# EAGLE design robot (EAGLE 6.1)

## Sheet 1 of 6
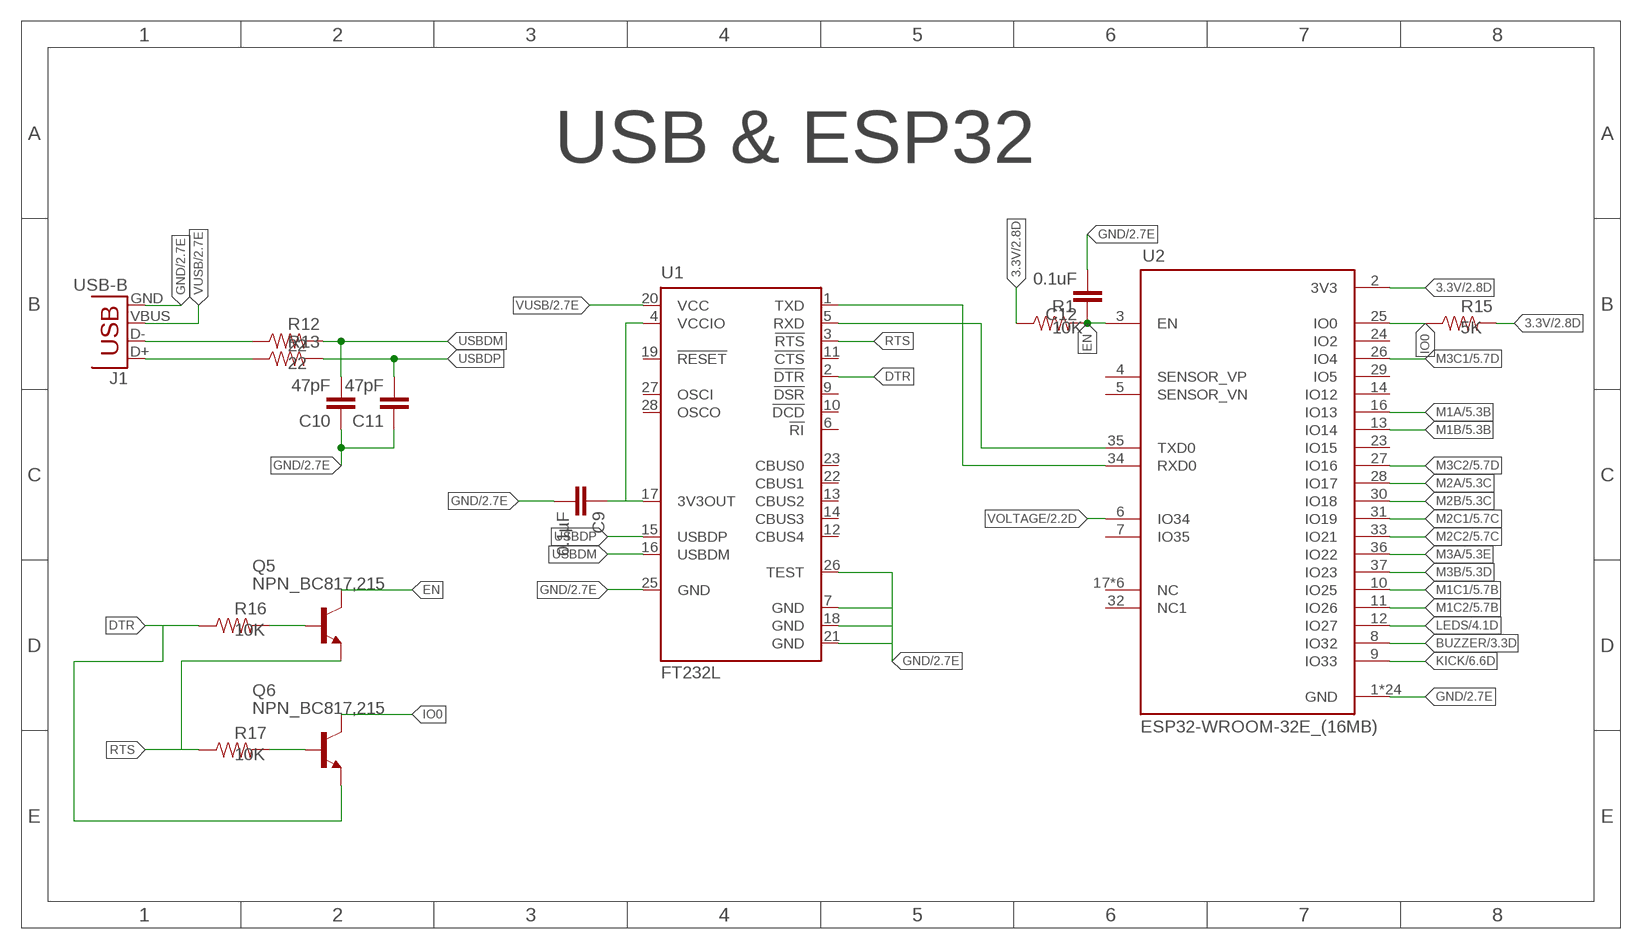
[diagram p0: schematic, sheet 1]

### Parts
C9  0.1µF  0.33UF/330NF-0805-50V-10%  [0805]
C10  47pF  CAP0805  [0805]
C11  47pF  CAP0805  [0805]
C12  0.1uF  CAP0805  [0805]
J1  USB-B  USBPTH  [USB-B-PTH]
Q5  NPN_BC817,215  [SOT-23]
Q6  NPN_BC817,215  [SOT-23]
R1  10K  0.3OHM-0805-1/8W-1%  [0805]
R12  22  0.3OHM-0805-1/8W-1%  [0805]
R13  22  0.3OHM-0805-1/8W-1%  [0805]
R15  5K  0.3OHM-0805-1/8W-1%  [0805]
R16  10K  0.3OHM-0805-1/8W-1%  [0805]
R17  10K  0.3OHM-0805-1/8W-1%  [0805]
U1  FT232L  [SSOP28]
U2  ESP32-WROOM-32E_(16MB)  [MODULE_ESP32-WROOM-32E_(16MB)]

### Nets
3.3V: R1.1 R15.2 U2.2(3V3) ; also sheet 2,3,5
BUZZER: U2.8(IO32) ; also sheet 3
DTR: Q6.2(E) R16.1 U1.2(!DTR)
EN: C12.1 Q5.3(C) R1.2 U2.3(EN)
GND [alime]: C9.2 C10.1 C11.1 C12.2 J1.GND U1.7(GND) U1.18(GND) U1.21(GND) U1.25(GND) U1.26(TEST) U2.1(GND) U2.15(GND) U2.38(GND) U2.39_1(GND) U2.39_2(GND) U2.39_3(GND) U2.39_4(GND) U2.39_5(GND) U2.39_6(GND) U2.39_7(GND) U2.39_8(GND) U2.39_9(GND) U2.39_10(GND) U2.39_11(GND) U2.39_12(GND) U2.39_13(GND) U2.39_14(GND) U2.39_15(GND) U2.39_16(GND) U2.39_17(GND) U2.39_18(GND) U2.39_19(GND) U2.39_20(GND) U2.39_21(GND) ; also sheet 2,3,4,5,6
IO0: Q6.3(C) R15.1 U2.25(IO0)
KICK: U2.9(IO33) ; also sheet 6
LEDS: U2.12(IO27) ; also sheet 4
M1A: U2.16(IO13) ; also sheet 5
M1B: U2.13(IO14) ; also sheet 5
M1C1: U2.10(IO25) ; also sheet 5
M1C2: U2.11(IO26) ; also sheet 5
M2A: U2.28(IO17) ; also sheet 5
M2B: U2.30(IO18) ; also sheet 5
M2C1: U2.31(IO19) ; also sheet 5
M2C2: U2.33(IO21) ; also sheet 5
M3A: U2.36(IO22) ; also sheet 5
M3B: U2.37(IO23) ; also sheet 5
M3C1: U2.26(IO4) ; also sheet 5
M3C2: U2.27(IO16) ; also sheet 5
N$6: U1.1(TXD) U2.34(RXD0)
N$14: U1.5(RXD) U2.35(TXD0)
N$15: C9.1 U1.4(VCCIO) U1.17(3V3OUT)
N$16: Q5.1(B) R16.2
N$17: Q6.1(B) R17.2
N$59: J1.D- R12.1
N$60: J1.D+ R13.1
RTS: Q5.2(E) R17.1 U1.3(!RTS)
USBDM: C10.2 R12.2 U1.16(USBDM)
USBDP: C11.2 R13.2 U1.15(USBDP)
VOLTAGE: U2.6(IO34) ; also sheet 2
VUSB [alime]: J1.VBUS U1.20(VCC) ; also sheet 2
Unconnected: U1.6(!RI) U1.9(!DSR) U1.10(!DCD) U1.11(!CTS) U1.12(CBUS4) U1.13(CBUS2) U1.14(CBUS3) U1.19(!RESET) U1.22(CBUS1) U1.23(CBUS0) U1.27(OSCI) U1.28(OSCO) U2.4(SENSOR_VP) U2.5(SENSOR_VN) U2.7(IO35) U2.14(IO12) U2.17(NC) U2.18(NC) U2.19(NC) U2.20(NC) U2.21(NC) U2.22(NC) U2.23(IO15) U2.24(IO2) U2.29(IO5) U2.32(NC1)

### Notes on the sheet
- USB & ESP32

## Sheet 2 of 6
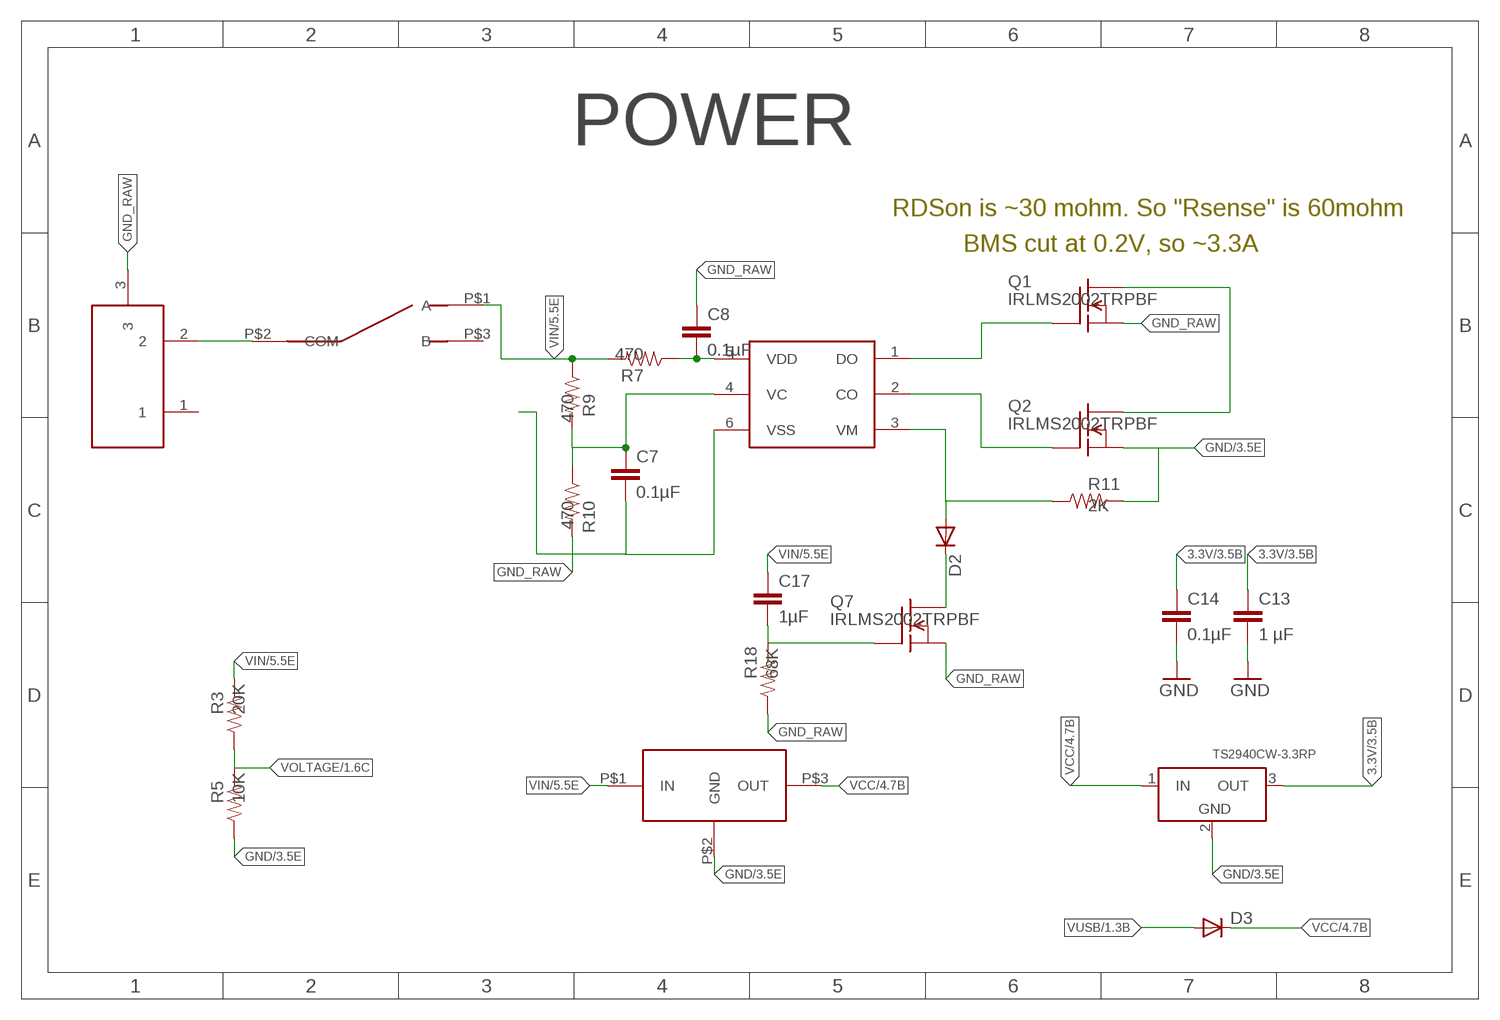
[diagram p1: schematic, sheet 2]

### Parts
C7  0.1µF  0.33UF/330NF-0805-50V-10%  [0805]
C8  0.1µF  0.33UF/330NF-0805-50V-10%  [0805]
C13  1 µF  0.33UF/330NF-0805-50V-10%  [0805]
C14  0.1µF  0.33UF/330NF-0805-50V-10%  [0805]
C17  1µF  0.33UF/330NF-0805-50V-10%  [0805]
D2  DIODESOD  [SOD-323]
D3  DIODESOD  [SOD-323]
J2  DC21MMX  [DC-21MM]
Q1  IRLMS2002TRPBF  [SOT23-6]
Q2  IRLMS2002TRPBF  [SOT23-6]
Q7  IRLMS2002TRPBF  [SOT23-6]
R3  20K  0.3OHM-0805-1/8W-1%  [0805]
R5  10K  0.3OHM-0805-1/8W-1%  [0805]
R7  470  0.3OHM-0805-1/8W-1%  [0805]
R9  470  0.3OHM-0805-1/8W-1%  [0805]
R10  470  0.3OHM-0805-1/8W-1%  [0805]
R11  2K  0.3OHM-0805-1/8W-1%  [0805]
R18  68K  0.3OHM-0805-1/8W-1%  [0805]
REG1  REG_5V  [TRACOPOWER]
SW1  L102011ML04Q  [L102011ML04Q]
U3  S8252  [SOT23-6]
U8  TS2940CW-3.3RP  [SOT223]

### Nets
3.3V: C13.1 C14.1 U8.3(OUT) ; also sheet 1,3,5
GND [alime]: C13.2 C14.2 Q2.4(S) R5.1 R11.2 REG1.P$2(GND) U8.2(GND) ; also sheet 1,3,4,5,6
GND_RAW [alime]: C7.2 C8.1 J2.3 Q1.4(S) Q7.4(S) R10.2 R18.1 U3.6(VSS)
N$7 [alime]: J2.2 SW1.P$2(COM)
N$8: C8.2 R7.1 U3.5(VDD)
N$9: C7.1 R9.2 R10.1 U3.4(VC)
N$10: Q1.1(D) Q1.2(D) Q1.5(D) Q1.6(D) Q2.1(D) Q2.2(D) Q2.5(D) Q2.6(D)
N$11: Q2.3(G) U3.2(CO)
N$12: Q1.3(G) U3.1(DO)
N$13: D2.2(A) R11.1 U3.3(VM)
N$19: C17.2 Q7.3(G) R18.2
N$22: D2.1(C) Q7.1(D) Q7.2(D) Q7.5(D) Q7.6(D)
VCC [alime]: D3.1(C) REG1.P$3(OUT) U8.1(IN) ; also sheet 4
VIN [alime]: C17.1 R3.2 R7.2 R9.1 REG1.P$1(IN) SW1.P$1(A) ; also sheet 5,6
VOLTAGE: R3.1 R5.2 ; also sheet 1
VUSB [alime]: D3.2(A) ; also sheet 1
Unconnected: SW1.P$3(B)

### Notes on the sheet
- POWER
- RDSon is ~30 mohm. So "Rsense" is 60mohm
- BMS cut at 0.2V, so ~3.3A

## Sheet 3 of 6
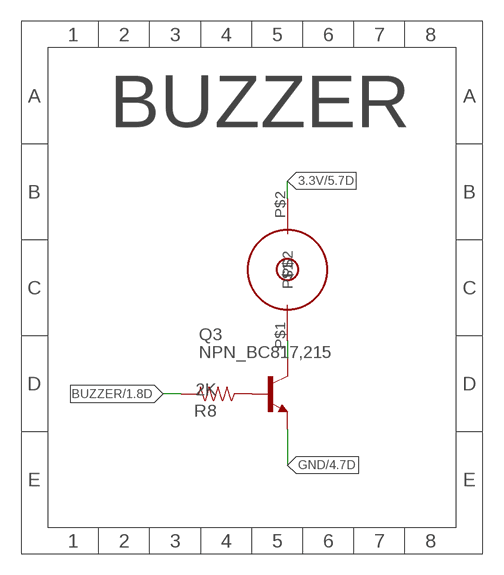
[diagram p2: schematic, sheet 3]

### Parts
B1  BUZZER66  [BUZZER66]
Q3  NPN_BC817,215  [SOT-23]
R8  2K  0.3OHM-0805-1/8W-1%  [0805]

### Nets
3.3V: B1.P$2 ; also sheet 1,2,5
BUZZER: R8.2 ; also sheet 1
GND [alime]: Q3.2(E) ; also sheet 1,2,4,5,6
N$3: Q3.1(B) R8.1
N$5: B1.P$1 Q3.3(C)

### Notes on the sheet
- BUZZER

## Sheet 4 of 6
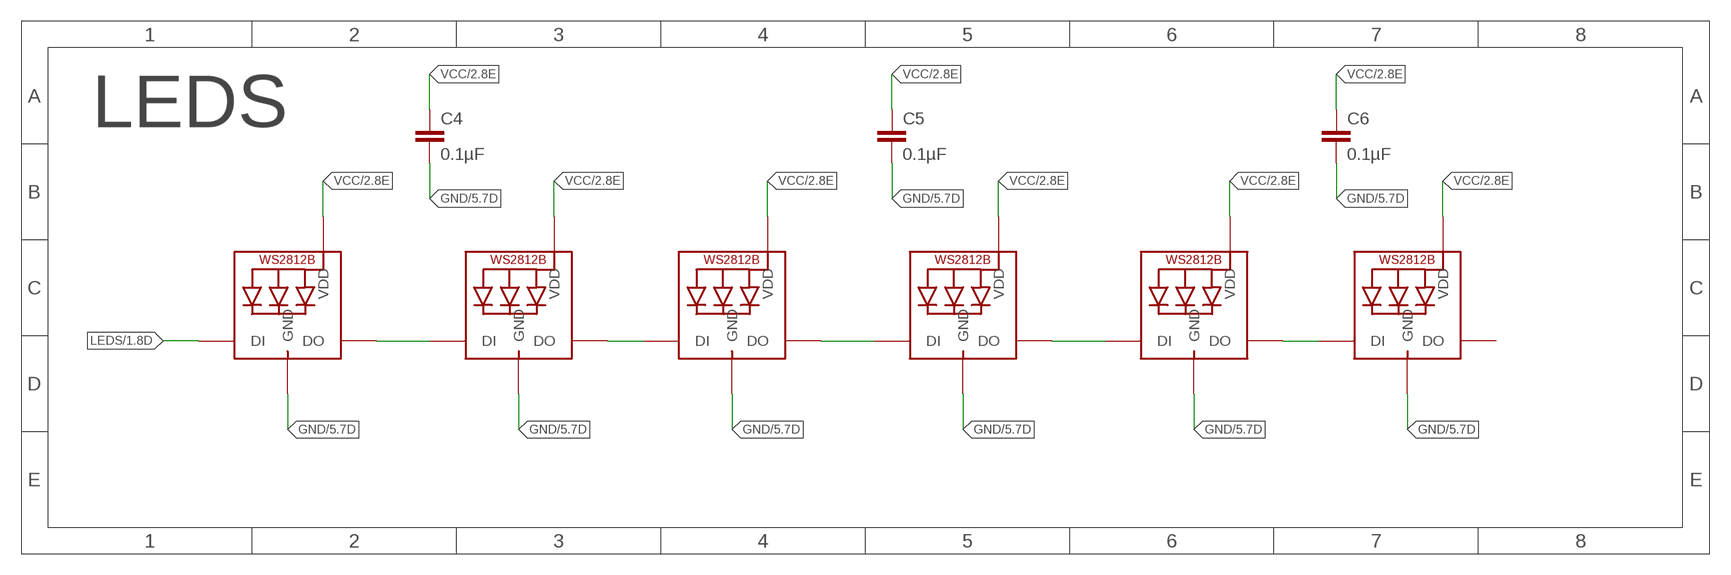
[diagram p3: schematic, sheet 4]

### Parts
C4  0.1µF  0.33UF/330NF-0805-50V-10%  [0805]
C5  0.1µF  0.33UF/330NF-0805-50V-10%  [0805]
C6  0.1µF  0.33UF/330NF-0805-50V-10%  [0805]
LED1  WS2812B5050  [WS2812B]
LED2  WS2812B5050  [WS2812B]
LED3  WS2812B5050  [WS2812B]
LED4  WS2812B5050  [WS2812B]
LED5  WS2812B5050  [WS2812B]
LED6  WS2812B5050  [WS2812B]

### Nets
GND [alime]: C4.2 C5.2 C6.2 LED1.3-GND(GND) LED2.3-GND(GND) LED3.3-GND(GND) LED4.3-GND(GND) LED5.3-GND(GND) LED6.3-GND(GND) ; also sheet 1,2,3,5,6
LEDS: LED1.4-DIN(DI) ; also sheet 1
N$27: LED1.2-DOUT(DO) LED2.4-DIN(DI)
N$28: LED2.2-DOUT(DO) LED3.4-DIN(DI)
N$30: LED4.2-DOUT(DO) LED5.4-DIN(DI)
N$32: LED5.2-DOUT(DO) LED6.4-DIN(DI)
N$39: LED3.2-DOUT(DO) LED4.4-DIN(DI)
VCC [alime]: C4.1 C5.1 C6.1 LED1.1-VDD(VDD) LED2.1-VDD(VDD) LED3.1-VDD(VDD) LED4.1-VDD(VDD) LED5.1-VDD(VDD) LED6.1-VDD(VDD) ; also sheet 2
Unconnected: LED6.2-DOUT(DO)

### Notes on the sheet
- LEDS

## Sheet 5 of 6
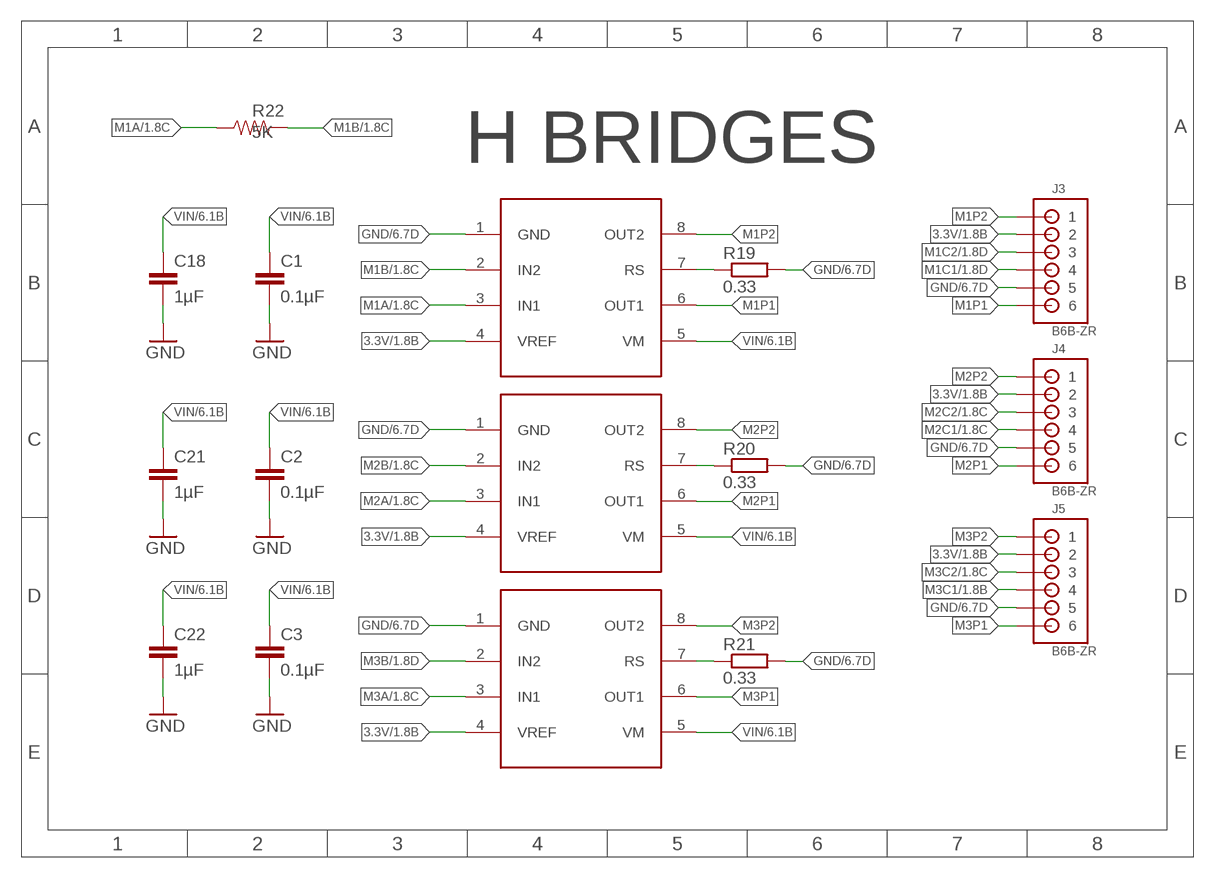
[diagram p4: schematic, sheet 5]

### Parts
C1  0.1µF  0.33UF/330NF-0805-50V-10%  [0805]
C2  0.1µF  0.33UF/330NF-0805-50V-10%  [0805]
C3  0.1µF  0.33UF/330NF-0805-50V-10%  [0805]
C18  1µF  0.33UF/330NF-0805-50V-10%  [0805]
C21  1µF  0.33UF/330NF-0805-50V-10%  [0805]
C22  1µF  0.33UF/330NF-0805-50V-10%  [0805]
J3  B6B-ZR  [B6B-ZR]
J4  B6B-ZR  [B6B-ZR]
J5  B6B-ZR  [B6B-ZR]
R19  0.33  R-EU_R1206  [R1206]
R20  0.33  R-EU_R1206  [R1206]
R21  0.33  R-EU_R1206  [R1206]
R22  5K  0.3OHM-0805-1/8W-1%  [0805]
U10  TB67H450FNG  [HSOP8]
U11  TB67H450FNG  [HSOP8]
U12  TB67H450FNG  [HSOP8]

### Nets
3.3V: J3.2 J4.2 J5.2 U10.4(VREF) U11.4(VREF) U12.4(VREF) ; also sheet 1,2,3
GND [alime]: C1.2 C2.2 C3.2 C18.2 C21.2 C22.2 J3.5 J4.5 J5.5 R19.2 R20.2 R21.2 U10.1(GND) U11.1(GND) U12.1(GND) ; also sheet 1,2,3,4,6
M1A: R22.1 U10.3(IN1) ; also sheet 1
M1B: R22.2 U10.2(IN2) ; also sheet 1
M1C1: J3.4 ; also sheet 1
M1C2: J3.3 ; also sheet 1
M1P1 [alime]: J3.6 U10.6(OUT1)
M1P2 [alime]: J3.1 U10.8(OUT2)
M2A: U11.3(IN1) ; also sheet 1
M2B: U11.2(IN2) ; also sheet 1
M2C1: J4.4 ; also sheet 1
M2C2: J4.3 ; also sheet 1
M2P1 [alime]: J4.6 U11.6(OUT1)
M2P2 [alime]: J4.1 U11.8(OUT2)
M3A: U12.3(IN1) ; also sheet 1
M3B: U12.2(IN2) ; also sheet 1
M3C1: J5.4 ; also sheet 1
M3C2: J5.3 ; also sheet 1
M3P1 [alime]: J5.6 U12.6(OUT1)
M3P2 [alime]: J5.1 U12.8(OUT2)
N$18 [alime]: R19.1 U10.7(RS)
N$20 [alime]: R20.1 U11.7(RS)
N$21 [alime]: R21.1 U12.7(RS)
VIN [alime]: C1.1 C2.1 C3.1 C18.1 C21.1 C22.1 U10.5(VM) U11.5(VM) U12.5(VM) ; also sheet 2,6

### Notes on the sheet
- H BRIDGES

## Sheet 6 of 6
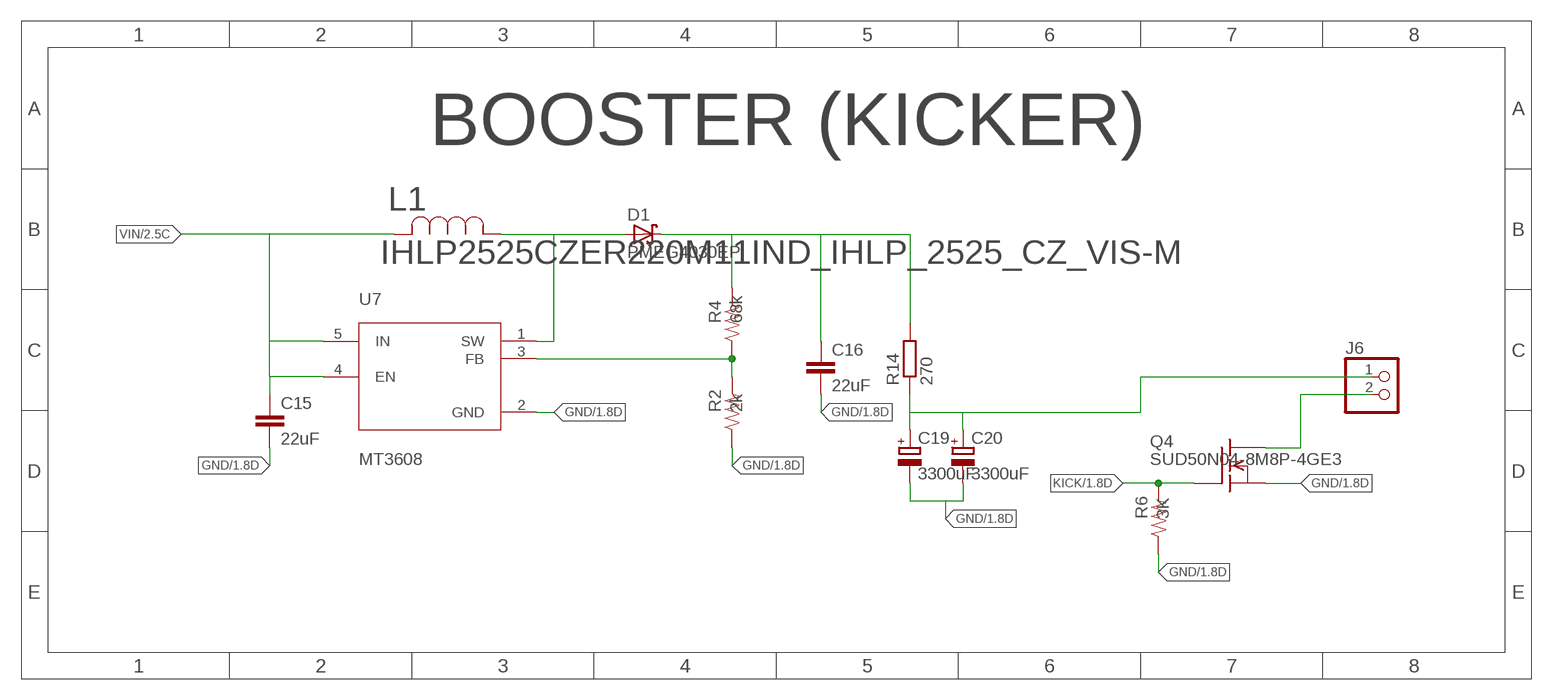
[diagram p5: schematic, sheet 6]

### Parts
C15  22uF  C-EUC0805  [C0805]
C16  22uF  C-EUC0805  [C0805]
C19  3300uF  CPOL-EUE5-13  [E5-13]
C20  3300uF  CPOL-EUE5-13  [E5-13]
D1  PMEG4030EP  [SOD128]
J6  KICKER  [KICKER]
L1  IHLP2525CZER220M11IND_IHLP_2525_CZ_VIS-M  [IND_IHLP_2525_CZ_VIS-M]
Q4  SUD50N04-8M8P-4GE3  [TO252]
R2  2k  0.3OHM-0805-1/8W-1%  [0805]
R4  68k  0.3OHM-0805-1/8W-1%  [0805]
R6  3K  0.3OHM-0805-1/8W-1%  [0805]
R14  270  R-EU_R2010  [R2010]
U7  MT3608  [SOT95P280X145-6N]

### Nets
GND [alime]: C15.2 C16.2 C19.- C20.- Q4.2(S) R2.1 R6.1 U7.2(GND) ; also sheet 1,2,3,4,5
KICK: Q4.1(G) R6.2 ; also sheet 1
KICKER: J6.2 Q4.3(D)
N$1: D1.2(A) L1.1 U7.1(SW)
N$2: C16.1 D1.1(K) R4.2 R14.2
N$4: R2.2 R4.1 U7.3(FB)
VIN [alime]: C15.1 L1.2 U7.4(EN) U7.5(IN) ; also sheet 2,5
VSTORE: C19.+ C20.+ J6.1 R14.1

### Notes on the sheet
- BOOSTER (KICKER)

## Power pins joined to a net without a drawn wire
1: J2.1

## Library data of the parts
B1 = rhoban:BUZZER; FARNELL: CEM-1203
C1-C9 C13 C14 C18 C21 C22 = SparkFun-Capacitors:0.33UF/330NF: 0.33µF/330nF ceramic capacitors A capacitor is a passive two-terminal electrical component used to store electrical energy temporarily in an electric field.; FARNELL: 2688486RL; PROD_ID: CAP-08469; VALUE: 0.33µF
C10-C12 = SparkFun-Passives:CAP: Capacitor Standard 0603 ceramic capacitor, and 0.1" leaded capacitor.; FARNELL: 1081223
C15 C16 = resistor:C-EU: CAPACITOR, European symbol; FARNELL: 2666560
C17 = SparkFun-Capacitors:0.33UF/330NF: 0.33µF/330nF ceramic capacitors A capacitor is a passive two-terminal electrical component used to store electrical energy temporarily in an electric field.; FARNELL: 3010154; PROD_ID: CAP-08469; VALUE: 0.33µF
C19 C20 = rcl:CPOL-EU: POLARIZED CAPACITOR, European symbol; MOUSER: 710-860160278042
D1 = nxp_60:PMEG4030E: 40 V, 3 A low VF MEGA Schottky barrier rectifier Planar Maximum Efficiency General Application (MEGA) Schottky barrier rectifier with an integrated guard ring for stress protection. AAL Eindhoven MK; FARNELL: 1829201
D2 D3 = SparkFun-DiscreteSemi:DIODE: Diode These are standard reverse protection diodes and small signal diodes. SMA package can handle up to about 1A. SOD-323 can handle about 200mA. What the SOD-323 package when ordering, there are some mfgs out there that are 5-pin packages.; FARNELL: 8737843RL
J1 = SparkFun-Connectors:USB: USB Connectors USB-B-PTH is fully proven SKU : PRT-00139/CONN-08278 USB-miniB is fully proven SKU : PRT-00587 USB-A-PCB is untested. USB-A-H is throughly reviewed, but untested. Spark Fun Electronics SKU : PRT-00437 USB-B-SMT is throughly reviewed, but untested. Needs silkscreen touching up. USB-A-S has not been used/tested USB-MB-H has not been used/tested USB-MICROB has been used. CONN-09505; FARNELL: 1308876; PROD_ID: CONN-08278
J2 = powersupply:DC21MM; FARNELL: 1217037
J3-J5 = jst:B6B-ZR: JST-ZH Connector 6 pol, 1.5mm pitch Package: B6B-ZR Source: http://www.jst-mfg.com/product/pdf/eng/eZH.pdf; FARNELL: 9491805
J6 = rhoban:KICKER; FARNELL: JF-0530B
L1 = INDUCTOR:IHLP2525CZER220M11; BUILT_BY: EMA_UL_Team; FARNELL: 1741369; MANUFACTURER_PART_NUMBER: IHLP2525CZER220M11; SOURCELIBRARY: Vishay_2020-02-10; VENDOR: Vishay
LED1-LED6 = adafruit:WS2812B; FARNELL: WS2812B 5050
Q1 Q2 Q7 = rhoban:IRLMS2002TRPBF; FARNELL: 2577180RL
Q3 Q5 Q6 = rhoban:NPN; FARNELL: 1081223
Q4 = rhoban:SUD50N04-8M8P-4GE3; FARNELL: 1794799
R1 R12 R13 R15-R17 R22 = SparkFun-Resistors:0.3OHM: 0.3Ω resistor A resistor is a passive two-terminal electrical component that implements electrical resistance as a circuit element. Resistors act to reduce current flow, and, at the same time, act to lower voltage levels within circuits. - Wikipedia; FARNELL: 2446926; PROD_ID: RES-11622; VALUE: 0.3
R2 R8 R11 = SparkFun-Resistors:0.3OHM: 0.3Ω resistor A resistor is a passive two-terminal electrical component that implements electrical resistance as a circuit element. Resistors act to reduce current flow, and, at the same time, act to lower voltage levels within circuits. - Wikipedia; FARNELL: 2447622; PROD_ID: RES-11622; VALUE: 0.3
R3 = SparkFun-Resistors:0.3OHM: 0.3Ω resistor A resistor is a passive two-terminal electrical component that implements electrical resistance as a circuit element. Resistors act to reduce current flow, and, at the same time, act to lower voltage levels within circuits. - Wikipedia; FARNELL: 2074395; PROD_ID: RES-11622; VALUE: 0.3
R4 = SparkFun-Resistors:0.3OHM: 0.3Ω resistor A resistor is a passive two-terminal electrical component that implements electrical resistance as a circuit element. Resistors act to reduce current flow, and, at the same time, act to lower voltage levels within circuits. - Wikipedia; FARNELL: 2447023; PROD_ID: RES-11622; VALUE: 0.3
R5 R9 R10 = SparkFun-Resistors:0.3OHM: 0.3Ω resistor A resistor is a passive two-terminal electrical component that implements electrical resistance as a circuit element. Resistors act to reduce current flow, and, at the same time, act to lower voltage levels within circuits. - Wikipedia; FARNELL: 2074334RL; PROD_ID: RES-11622; VALUE: 0.3
R6 = SparkFun-Resistors:0.3OHM: 0.3Ω resistor A resistor is a passive two-terminal electrical component that implements electrical resistance as a circuit element. Resistors act to reduce current flow, and, at the same time, act to lower voltage levels within circuits. - Wikipedia; FARNELL: 1887603; PROD_ID: RES-11622; VALUE: 0.3
R7 = SparkFun-Resistors:0.3OHM: 0.3Ω resistor A resistor is a passive two-terminal electrical component that implements electrical resistance as a circuit element. Resistors act to reduce current flow, and, at the same time, act to lower voltage levels within circuits. - Wikipedia; FARNELL: 2447662; PROD_ID: RES-11622; VALUE: 0.3
R14 = rcl:R-EU_: RESISTOR, European symbol; FARNELL: 1887603
R18 = SparkFun-Resistors:0.3OHM: 0.3Ω resistor A resistor is a passive two-terminal electrical component that implements electrical resistance as a circuit element. Resistors act to reduce current flow, and, at the same time, act to lower voltage levels within circuits. - Wikipedia; FARNELL: 2074486; PROD_ID: RES-11622; VALUE: 0.3
R19-R21 = rcl:R-EU_: RESISTOR, European symbol
REG1 = rhoban:REG_5V; FARNELL: 1696320
SW1 = rhoban:L102011ML04Q
U1 = rhoban:FT232: Source: http://www.ftdichip.com/Documents/DataSheets/DS_FT232R_v104.pdf; DATASHEET: ft232rl.pdf; FARNELL: 1146032; FARNELL_LINK: http://fr.farnell.com/ftdi/ft232rl/usb-vers-uart-cms-ssop28-232/dp/1146032?Ntt=1146032; MPN: FT232RL; OC_FARNELL: 1146032; OC_NEWARK: 91K9918
U2 = ESP32-WROOM-32E__16MB_:ESP32-WROOM-32E_(16MB): Bluetooth, WiFi 802.11b/g/n, Bluetooth v4.2 +EDR, Class 1, 2 and 3 Transceiver Module 2.4GHz ~ 2.5GHz Integrated, Trace Surface Mount Check availability; AVAILABILITY: In Stock; DESCRIPTION: Bluetooth, WiFi 802.11b/g/n, Bluetooth v4.2 +EDR, Class 1, 2 and 3 Transceiver Module 2.4GHz ~ 2.5GHz Integrated, Trace Surface Mount; FARNELL: ESP32-WROOM; MF: Espressif Systems; MP: ESP32-WROOM-32E (16MB); PACKAGE: SMD-44 Espressif Systems; PRICE: None
U3 = rhoban:S8252; FARNELL: https://www.digikey.fr/fr/products/detail/ablic-u-s-a-inc/S-8252AAL-M6T1U/6121452; REF: S-8252AAL-M6T1U
U7 = MT3608:MT3608: High Efficiency 1.2MHz 2A Step Up Converter Check prices; AVAILABILITY: No availability data; DESCRIPTION: High Efficiency 1.2MHz 2A Step Up Converter; FARNELL: MT3608; MF: Aerosemi Technology Co., Ltd; MP: MT3608; PACKAGE: Package; PRICE: None
U8 = rhoban:TS2940CW-3.3RP; FARNELL: 7261403
U10-U12 = rhoban:TB67H450FNG

## Net classes
0 default: width 0.203 mm
1 alime: width 0.381 mm
2 bigalime: width 0.381 mm

## Board
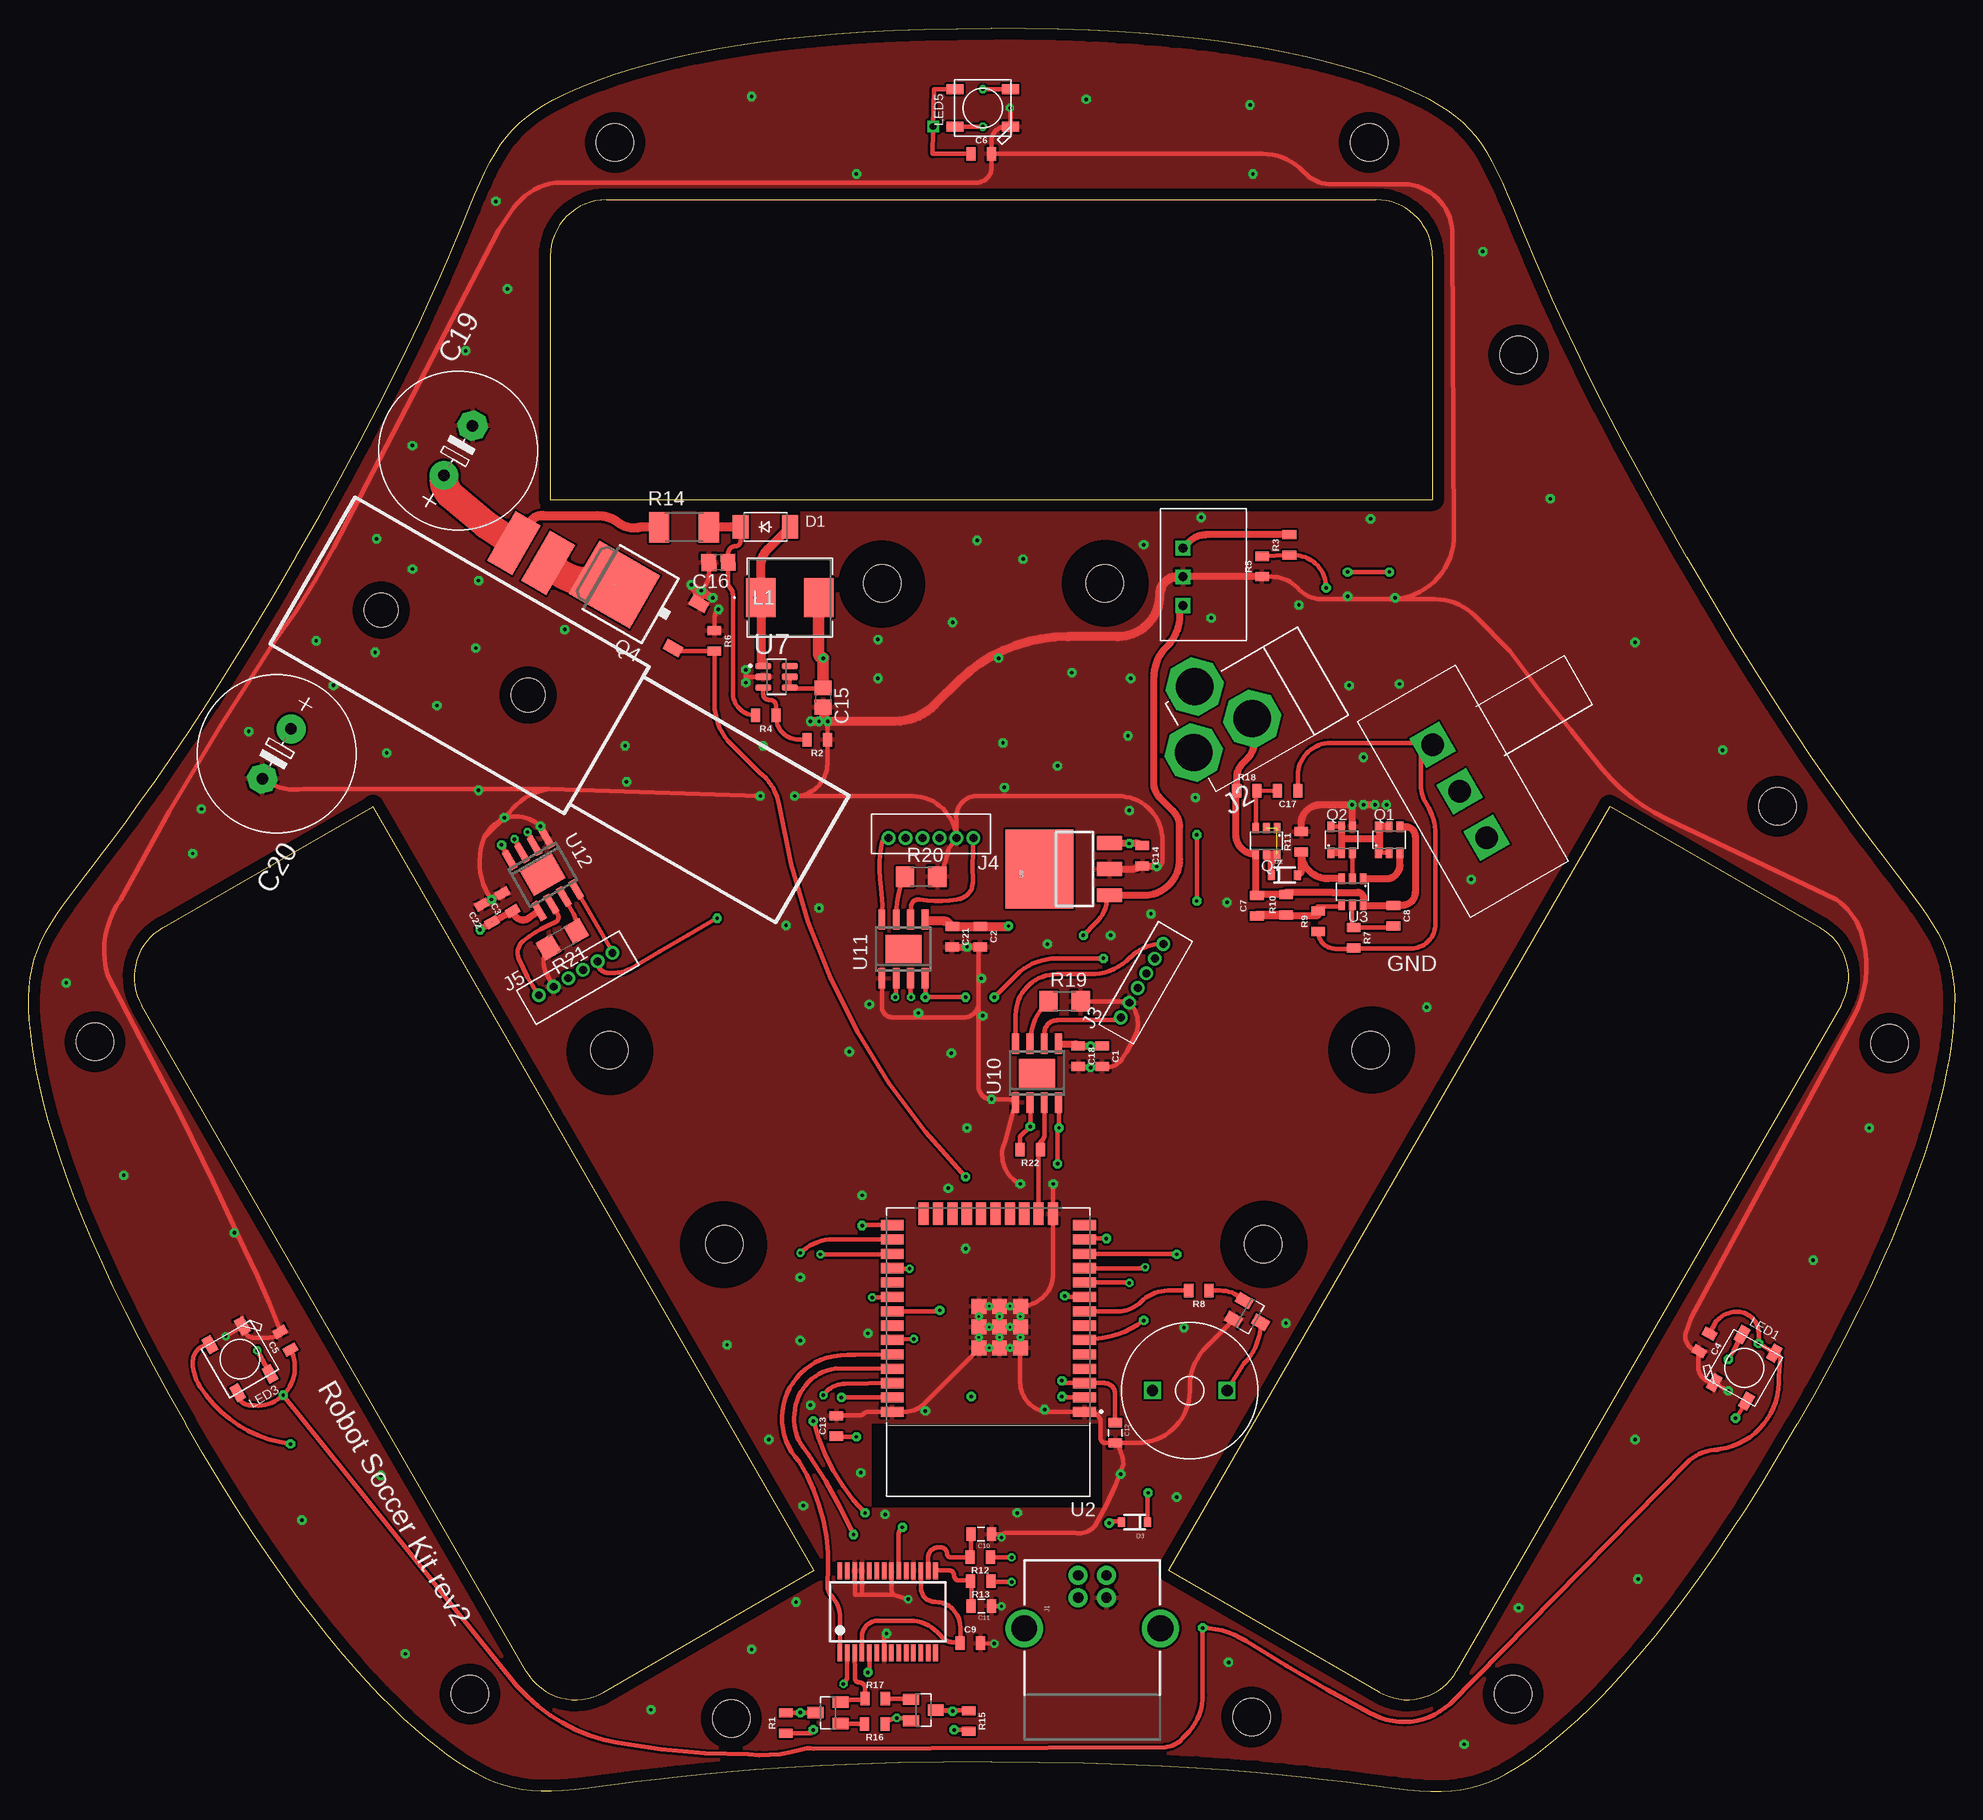
[diagram p6: board, top side]
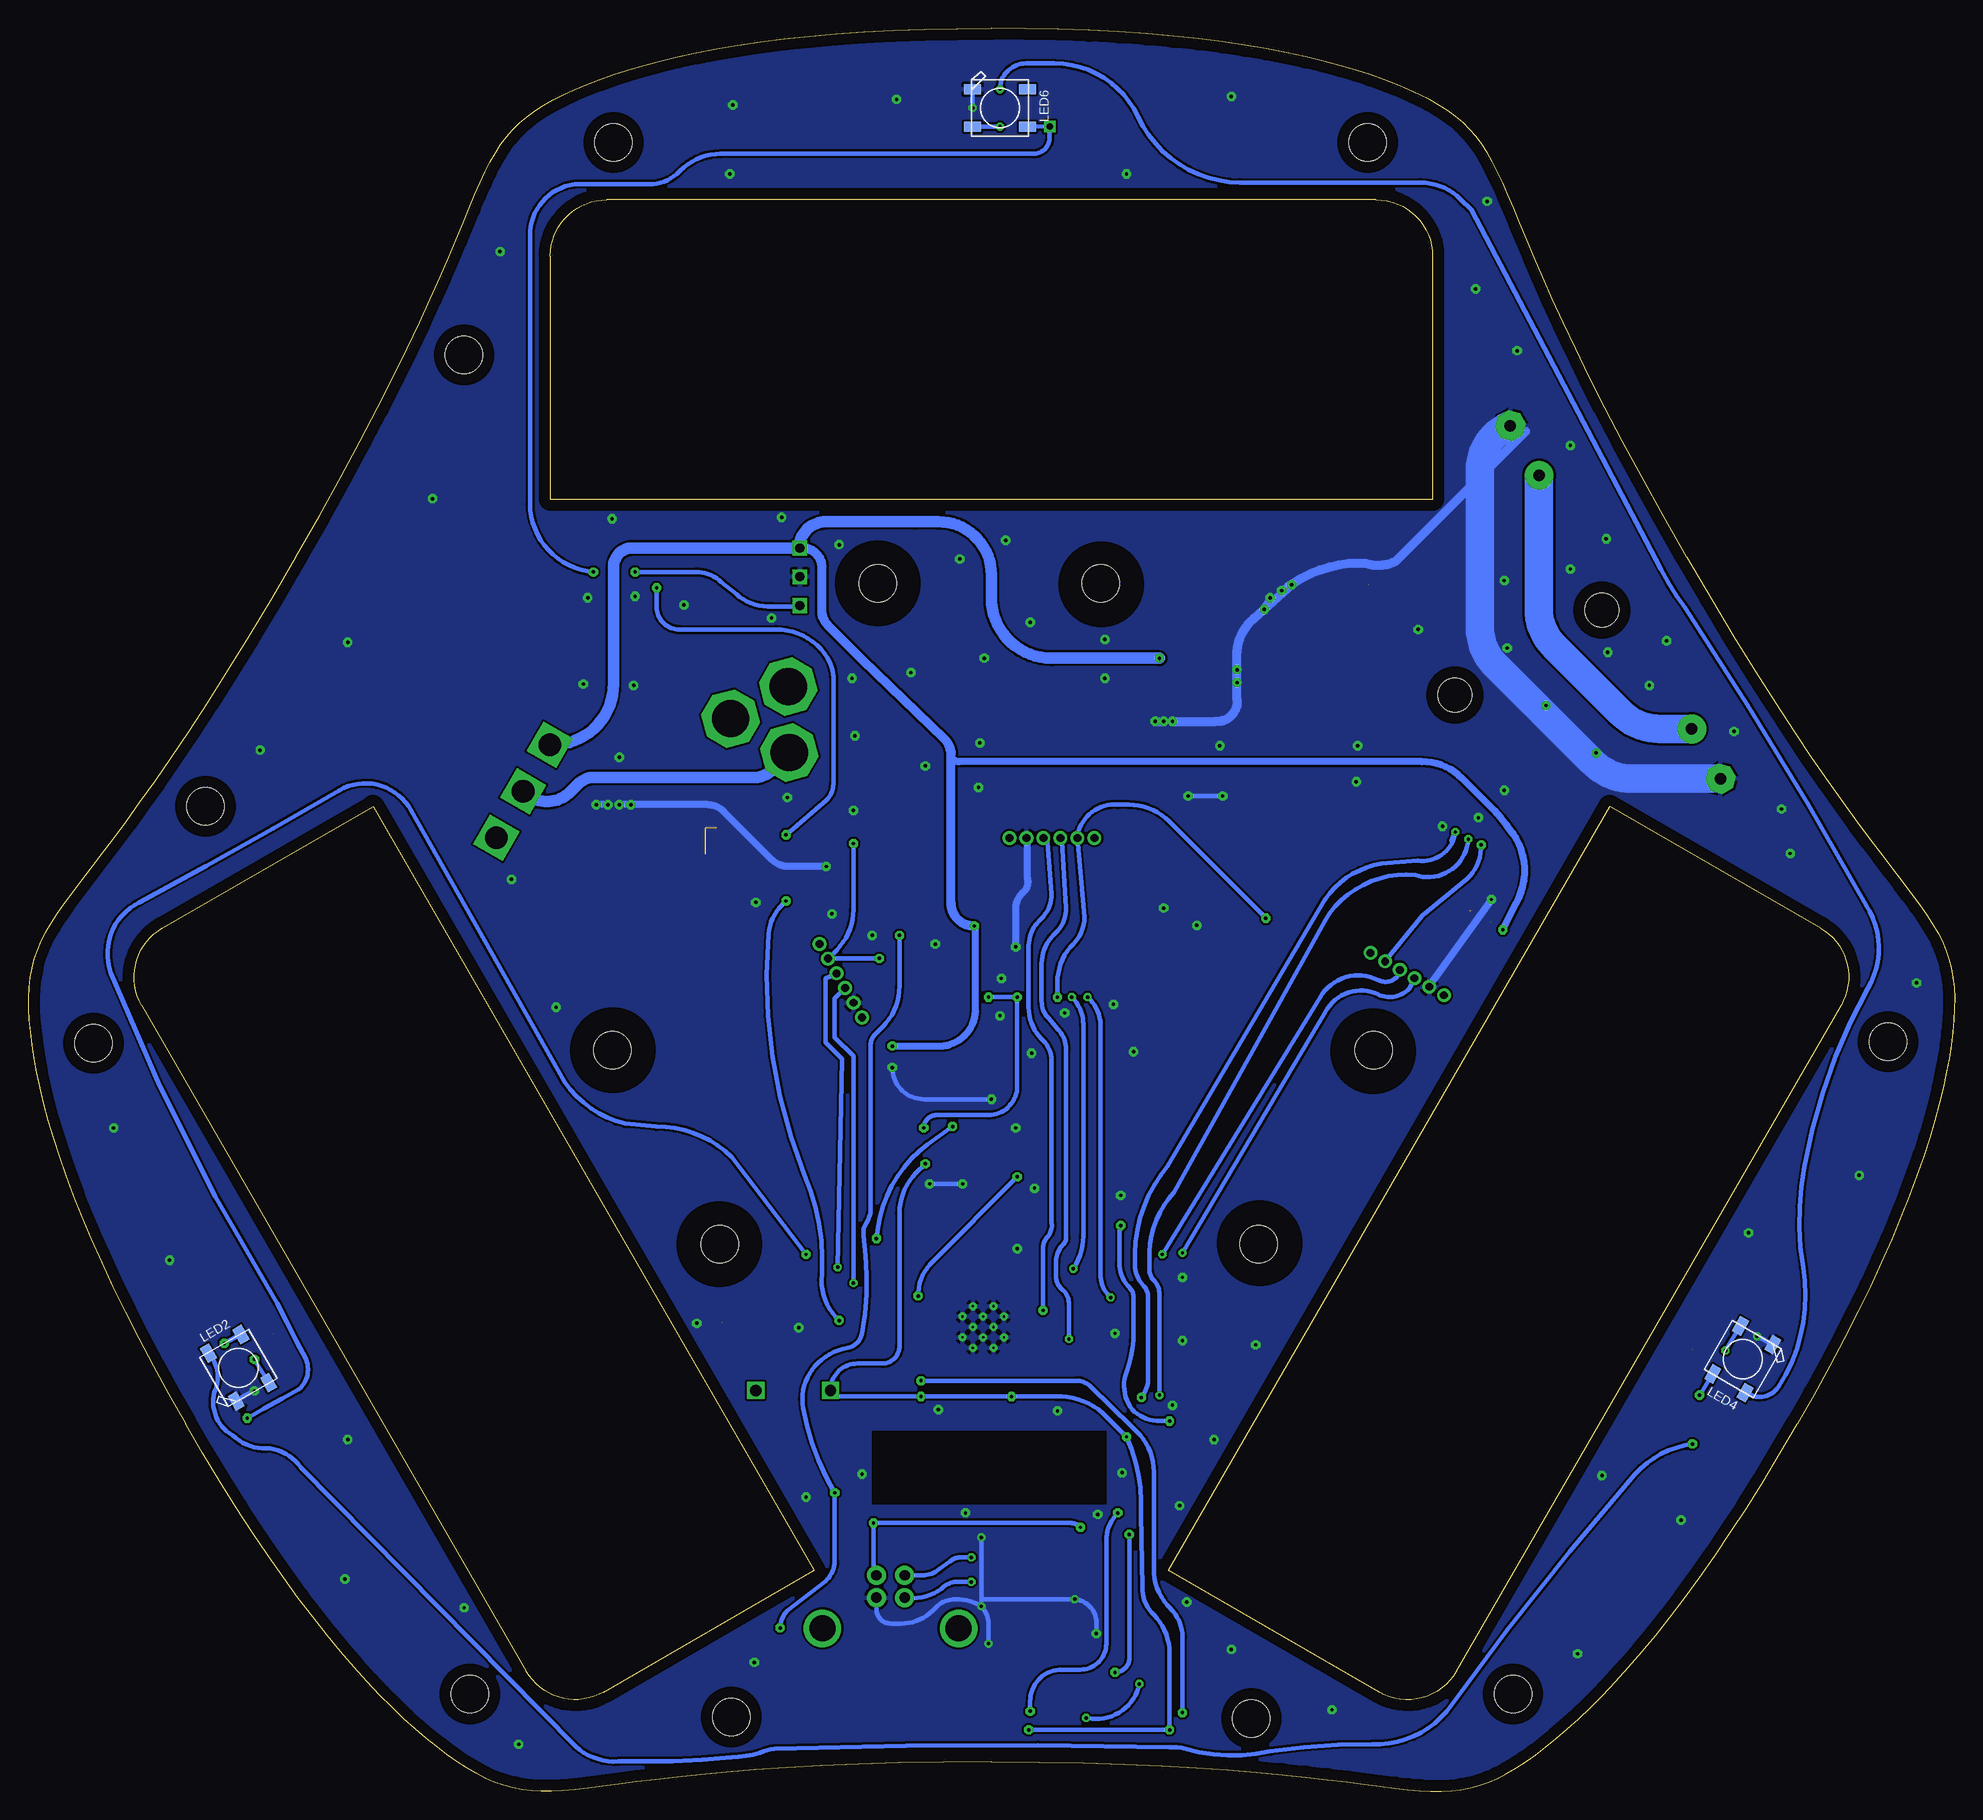
[diagram p7: board, bottom side, seen from below]

Size 170.28 x 155.86 mm. Coordinates in mm from the lower left corner, seen from the top.
Outline: 300 segments
Copper layers (1*16): Top 0.035mm / dielectric 1.5mm / Bottom 0.035mm
Design rules: minimum track width 6mil, minimum drill 0.3mm, track to track 0.205mm, track to pad 0.205mm, pad to pad 0.205mm, via to via 0.205mm, smd to smd 8mil, copper to edge 40mil, drill to drill 8mil, minimum pad ring 10mil, minimum via ring 8mil, stop-mask expansion 4mil, vias tented up to drill 25mil, thermal gap 10mil
tRestrict: area 47.6,61.6 to 55.2,69.2; area 57.6,44.5 to 65.3,52.2; area 114.9,61.7 to 122.6,69.4; area 105.4,44.5 to 113.1,52.2; area 71.6,102.9 to 79.3,110.6; area 91.4,103 to 99,110.6; area 74.6,25.1 to 94.9,32.5
bRestrict: area 47.6,61.6 to 55.2,69.2; area 57.7,44.7 to 65.2,52.2; area 114.8,61.8 to 122.4,69.3; area 105.4,44.6 to 113,52.1; area 71.6,102.9 to 79.2,110.5; area 91.4,103 to 98.9,110.6; area 75,25.4 to 95.7,31.9

### Footprints (pad centres in the part's own frame; a part is rotated, then mirrored left to right if it is on the bottom)
BUZZER66 = drill 1 square: P$1 -3.3,0; P$2 3.3,0
0805 = smd 0.8 x 1.2: 1 -0.9,0; 2 0.9,0
C0805 = smd 1.3 x 1.5: 1 -0.85,0; 2 0.85,0
E5-13 = drill 1.016 pad 2.54: + -2.54,0 | drill 1.016 pad 2.54 octagon: - 2.54,0
SOD128 = smd 1.4 x 2.1: 1 -2.2,0; 2 2.2,0
SOD-323 = smd 0.63 x 0.83: 1 -1.15,0; 2 1.15,0
USB-B-PTH = drill 0.914 pad 1.676: D+ 0,1.25; D- 1.981,1.25; GND 0,-1.25; VBUS 1.981,-1.25 | drill 2.286: S1 -2.718,-6.02; S2 -2.718,6.02
DC-21MM = drill 3.302 pad 4.826 octagon: 1 -5.08,-3.353; 2 -0.076,-6.35; 3 -0.076,-0.356
B6B-ZR = drill 0.7: 1 9,-1.3; 2 7.5,-1.3; 3 6,-1.3; 4 4.5,-1.3; 5 3,-1.3; 6 1.5,-1.3
KICKER = smd 2.54 x 5.08: 1 14.2,18.5; 2 17.7,18.5 | hole 3: 7,7.5; 22,7.5
IND_IHLP_2525_CZ_VIS-M = smd 2.625 x 3.429: 1 -2.557,0; 2 2.557,0
WS2812B = smd 1.5 x 0.9: 1-VDD 2.45,-1.65; 2-DOUT 2.45,1.65; 3-GND -2.45,1.65; 4-DIN -2.45,-1.65
SOT23-6 = smd 0.6 x 0.9: 1 -0.95,-1.15; 2 0,-1.15; 3 0.95,-1.15; 4 0.95,1.15; 5 0,1.15; 6 -0.95,1.15
SOT-23 = smd 1 x 1.4: 1 -0.95,-1.1; 2 0.95,-1.1; 3 0,1.1
TO252 = smd 1 x 1.6: 1 -2.28,-4.8; 2 2.28,-4.8 | smd 5.4 x 6.2: 3 0,2.5
R2010 = smd 1.8 x 2.7: 1 -2.2,0; 2 2.2,0
R1206 = smd 1.6 x 1.803: 1 -1.422,0; 2 1.422,0
TRACOPOWER = drill 0.8 square: P$1 3.5,2; P$2 6.04,2; P$3 8.58,2
L102011ML04Q = drill 2 square: P$1 0,0; P$2 0,4.75; P$3 0,9.5
SSOP28 = smd 0.4 x 1.5: 1 -4.225,-3.625; 2 -3.575,-3.625; 3 -2.925,-3.625; 4 -2.275,-3.625; 5 -1.625,-3.625; 6 -0.975,-3.625; 7 -0.325,-3.625; 8 0.325,-3.625; 9 0.975,-3.625; 10 1.625,-3.625; 11 2.275,-3.625; 12 2.925,-3.625; 13 3.575,-3.625; 14 4.225,-3.625; 15 4.225,3.625; 16 3.575,3.625; 17 2.925,3.625; 18 2.275,3.625; 19 1.625,3.625; 20 0.975,3.625; 21 0.325,3.625; 22 -0.325,3.625; 23 -0.975,3.625; 24 -1.625,3.625; 25 -2.275,3.625; 26 -2.925,3.625; 27 -3.575,3.625; 28 -4.225,3.625
MODULE_ESP32-WROOM-32E_(16MB) = smd 2 x 0.9: 1 -8.5,5.26; 2 -8.5,3.99; 3 -8.5,2.72; 4 -8.5,1.45; 5 -8.5,0.18; 6 -8.5,-1.09; 7 -8.5,-2.36; 8 -8.5,-3.63; 9 -8.5,-4.9; 10 -8.5,-6.17; 11 -8.5,-7.44; 12 -8.5,-8.71; 13 -8.5,-9.98; 14 -8.5,-11.25; 25 8.5,-11.25; 26 8.5,-9.98; 27 8.5,-8.71; 28 8.5,-7.44; 29 8.5,-6.17; 30 8.5,-4.9; 31 8.5,-3.63; 32 8.5,-2.36; 33 8.5,-1.09; 34 8.5,0.18; 35 8.5,1.45; 36 8.5,2.72; 37 8.5,3.99; 38 8.5,5.26 | smd 0.9 x 2: 15 -5.715,-12.25; 16 -4.445,-12.25; 17 -3.175,-12.25; 18 -1.905,-12.25; 19 -0.635,-12.25; 20 0.635,-12.25; 21 1.905,-12.25; 22 3.175,-12.25; 23 4.445,-12.25; 24 5.715,-12.25 | smd 1.33 x 1.33: 39_1 -2.835,-0.405; 39_2 -1,-0.405; 39_3 0.835,-0.405; 39_4 -2.835,-2.24; 39_5 -1,-2.24; 39_6 0.835,-2.24; 39_7 -2.835,-4.075; 39_8 -1,-4.075; 39_9 0.835,-4.075 | drill 0.2 pad 0.3: 39_10 -1.917,-0.405; 39_11 -0.083,-0.405; 39_12 -2.835,-1.323; 39_13 -1,-1.323; 39_14 0.835,-1.323; 39_15 -1.917,-2.24; 39_16 -0.083,-2.24; 39_17 -2.835,-3.158; 39_18 -1,-3.158; 39_19 0.835,-3.158; 39_20 -1.917,-4.075; 39_21 -0.083,-4.075
SOT95P280X145-6N = smd 1.37 x 0.59: 1 -1.17,0.95; 2 -1.17,0; 3 -1.17,-0.95; 4 1.17,-0.95; 5 1.17,0; 6 1.17,0.95
SOT223 = smd 1.219 x 2.235: 1 -2.311,-3.099; 2 0,-3.099; 3 2.311,-3.099 | smd 7 x 6: 4 0,3.099
HSOP8 = smd 0.6 x 1.8: 1 -1.905,-2.6; 2 -0.635,-2.6; 3 0.635,-2.6; 4 1.905,-2.6; 5 1.905,2.6; 6 0.635,2.6; 7 -0.635,2.6; 8 -1.905,2.6 | smd 3.2 x 2.51: EXP 0,0
STAND-OFF = hole 3.302: 0,0

### Placement (x,y rotation side)
B1  102.67,35.43 180 top
C1  94.93,64.98 270 top
C2  84.15,75.55 270 top
C3  42.37,78.61 120 top
C4  148.16,39.68 240 top
C5  22.72,39.84 120 top
C6  84.25,144.76 0 top
C7  108.61,78.28 90 top
C8  120.68,77.39 270 top
C9  83.26,13.11 0 top
C10  84.23,22.73 180 top
C11  84.25,16.38 180 top
C12  96.09,31.7 270 top
C13  71.43,32.31 90 top
C14  98.48,82.7 270 top
C15  70.25,96.7 270 top
C16  61.01,108.64 181 top
C17  111.33,88.47 180 top
C18  92.82,65 270 top
C19  38,118.53 60 top
C20  21.96,91.72 240 top
C21  81.67,75.55 270 top
C22  40.54,77.61 120 top
D1  65.15,111.78 0 top
D2  111.05,81 0 top
D3  97.79,23.8 180 top
J1  94.06,17.12 90 top
J2  108.55,94.95 300 top
J3  94.71,67.77 60 top
J4  85.05,82.99 180 top
J5  43.19,70.76 30 top
J6  21.38,101.43 330 top
L1  67.32,105.53 0 top
LED1  151.69,37.44 60 top
LED2  151.69,37.44 120 bottom
LED3  18.72,38.2 300 top
LED4  18.72,38.2 240 bottom
LED5  84.38,148.82 180 top
LED6  84.38,148.82 0 bottom
Q1  120.3,84.13 0 top
Q2  116.11,84.13 0 top
Q3  107.98,42.01 240 top
Q4  53.98,105.43 60 top
Q5  70.69,6.96 90 top
Q6  79.12,7.19 270 top
Q7  109.45,84.02 180 top
R1  66.96,6.05 90 top
R2  69.74,92.98 180 top
R3  111.48,110.19 90 top
R4  65.19,95.11 180 top
R5  109.07,108.28 90 top
R6  60.66,101.7 270 top
R7  117.17,75.46 270 top
R8  103.48,44.27 180 top
R9  114.02,76.91 90 top
R10  111.2,78.38 90 top
R11  112.52,83.95 90 top
R12  84.15,20.73 180 top
R13  84.2,18.59 180 top
R14  57.97,111.76 0 top
R15  83.14,6.22 270 top
R16  74.83,5.97 180 top
R17  74.86,8.2 0 top
R18  107.72,88.44 0 top
R19  91.61,69.83 0 top
R20  78.93,80.87 0 top
R21  47.21,75.33 210 top
R22  88.57,56.74 180 top
REG1  100.08,113.41 270 top
SW1  124.16,92.53 210 top
U1  75.97,15.88 0 top
U2  84.86,38.81 180 top
U3  117.05,79.53 180 top
U7  66.14,98.54 0 top
U8  92.48,81.53 90 top
U10  89.18,63.49 0 top
U11  77.36,74.47 0 top
U12  45.49,81.03 210 top
U$2  [STAND-OFF]  39.04,8.61 45 top
U$3  [STAND-OFF]  62.16,6.45 45 top
U$4  [STAND-OFF]  108.13,6.58 45 top
U$5  [STAND-OFF]  131.24,8.61 45 top
U$6  [STAND-OFF]  164.52,66.14 45 top
U$8  [STAND-OFF]  154.61,87.1 45 top
U$9  [STAND-OFF]  131.75,126.98 45 top
U$10  [STAND-OFF]  118.54,145.77 45 top
U$11  [STAND-OFF]  51.87,145.77 45 top
U$15  [STAND-OFF]  5.89,66.27 45 top
U$31  [STAND-OFF]  51.36,65.51 45 top
U$33  [STAND-OFF]  61.52,48.36 45 top
U$35  [STAND-OFF]  118.67,65.51 45 top
U$36  [STAND-OFF]  109.15,48.36 45 top
U$38  [STAND-OFF]  75.49,106.78 45 top
U$39  [STAND-OFF]  95.18,106.78 45 top

### Tracks (layer width: path | path; a pad name or v marks a point on that pad's centre or on a via)
3.3V  (via drill 0.3 pad 0.81)
  Top 0.406: U2.2 91.44,34.82 arc-90 v91.37,34.9 | U11.4 arc-45 79.3,71.78 v79.3,70.21 v82.86,70.21 | U12.4 v41.84,83.67 | U10.4 arc-90 91.11,60.86 v91.11,58.65 arc45 90.98,58.34 v90.98,55.47 | U8.3 97.28,83.85 arc-90 v97.33,83.8 | v85.4,70.21 87.36,72.17 arc-45 90.9,73.64 v95.05,73.64 | R1.1 69.1,5.15 arc90 v69.39,5.44 | v81.84,5.44 83.02,5.44 arc-90 R15.2 | v60.89,77.19 arc1 53.27,72.75 arc-31 51.87,72.37 51.23,72.37 arc-90 50.33,73.27 J5.2 | 71.43,31.47 C13.1 | 71.43,31.22 C13.1 | C13.1 arc45 71.58,31.34 v73.2,31.34
  Top 0.61: U8.3 97.89,83.85 arc-45 C14.1
  Bottom 0.406: v79.3,70.21 79.3,71.53 arc45 77.9,74.91 arc-45 76.91,77.3 J4.2 arc90 73.97,87.22 72.99,87.22 arc45 69.45,85.76 v60.89,77.19 | v41.84,83.67 arc45 43.09,80.63 47.04,77.45 50.34,73.38 | v91.11,58.65 arc90 89.97,59.79 85.4,59.79 arc-90 82.86,62.33 v82.86,70.21 v85.4,70.21 | v97.33,83.8 97.33,77.93 arc45 98.8,74.4 J3.2 arc45 99.61,73.63 99.62,73.64 v95.05,73.64 | v90.98,55.47 91.81,54.65 arc-45 93.27,51.12 93.27,39.35 arc90 94.79,37.82 96.98,37.82 arc-90 B1.P$2 arc-90 98.84,34.9 v91.37,34.9 v83.36,34.9 79.47,34.9 arc45 75.3,33.44 v73.2,31.34 arc29 71.93,24.49 71.81,18.05 arc-45 70.79,15.6 arc45 69.39,12.22 v69.39,5.44 v81.84,5.44 | 50.34,73.38 arc-45 50.34,73.38 | 50.34,73.38 arc-90 50.34,73.38 | 50.34,73.38 J5.2
BUZZER
  Top 0.406: U2.8 96.32,42.44 arc45 98.35,43.28 arc-45 100.74,44.27 R8.2
DTR  (via drill 0.3 pad 0.7)
  Top 0.406: U1.2 72.4,10.31 arc-45 v72.06,9.5 | R16.1 75.83,6.07 arc-45 76.76,6.45 | 76.76,6.45 77.65,6.45 arc-90 77.78,6.33 arc90 77.9,6.2 arc-90 77.94,6.24 Q6.2 | v76.76,6.49 76.76,6.45
  Bottom 0.406: v72.06,9.5 arc90 76.59,6.49 v76.76,6.49
EN  (via drill 0.3 pad 0.81)
  Top 0.406: Q5.3 v68.25,6.96 | v68.25,6.96 67.11,6.96 R1.2 68.22,6.95 arc45 v68.25,6.96 | C12.1 96.06,32.61 96.06,35.15 arc90 95.13,36.09 U2.3 91.57,36.09 arc-90 v91.37,36.3
  Bottom 0.406: v91.37,36.3 77.61,36.3 arc45 76.38,35.79 72.7,32.23 72.26,31.79 arc45 70.79,28.26 70.79,19.7 arc-45 69.33,16.16 69.27,16.1 arc45 68.25,13.65 v68.25,6.96
GND  (via drill 0.3 pad 0.7, 0.3 pad 0.81)
  Top 0.406: C9.2 84.2,13.11 v85.4,13.06 | C10.1 86.13,22.73 | 86.13,22.73 v86.03,22.45 | 70.64,95.47 C15.2 | C22.2 C3.2 | U2.39_8 U2.39_21 U2.39_9 U2.39_19 U2.39_6 | U2.39_6 U2.39_16 U2.39_5 | U2.39_5 U2.39_18 | U2.39_5 U2.39_15 U2.39_4 | U2.39_4 U2.39_17 U2.39_7 | U2.39_7 U2.39_20 | U2.39_5 U2.39_13 U2.39_2 | U2.39_4 U2.39_12 | U2.39_2 U2.39_10 U2.39_1 arc90 87.68,39.2 87.68,36.17 arc90 90.3,33.55 U2.1 93.86,33.55 arc-90 93.91,33.5 arc-90 94.79,32.61 94.79,31.22 arc90 95.21,30.8 C12.2 | U2.39_2 U2.39_11 | U2.39_6 U2.39_14 U2.39_3 arc-45 83.96,39.05 79.17,34.27 arc-45 77.45,33.55 U2.38 74.26,33.55 arc45 73.84,33.38 arc-45 73.53,33.25 71.43,33.25 C13.2 | C6.2 109.11,144.76 arc-45 112.64,143.29 113.08,142.85 arc45 115.54,142.09 121.59,142.09 arc-90 125.91,137.52 126.04,110.64 arc-90 119.89,105.39 | C6.2 arc-90 85.14,144.77 85.14,145.9 arc-90 86.41,147.17 LED5.3-GND 86.83,148.86 arc-90 v86.79,148.82 | C6.2 85.15,143.5 arc-90 83.75,142.22 46.57,142.22 arc45 42.91,139.99 41.58,138.02 26.98,109.96 arc-10 21.77,101.7 arc6 8.18,78.84 arc53 7.04,72.11 10.47,65.51 arc-4 19.1,47.98 arc-6 22.28,40.74 arc-46 C5.2 C5.2 arc-53 21.26,40.11 19.97,40.11 arc-90 LED3.3-GND 18.98,41.12 v17.45,40.23 | U1.26 73.08,17.37 73.59,17.37 | 73.59,17.37 76.51,17.37 | 76.51,17.37 v77.78,16.99 | U1.21 76.3,17.88 arc45 76.51,17.37 | U1.25 73.7,17.65 arc-45 73.59,17.37 | U1.7 75.65,13.72 arc-90 v75.87,13.95 | C11.1 arc45 85.21,16.36 v86.03,16.36 | v150.29,35.41 arc-9 LED1.3-GND arc-90 147.63,37.55 147.63,38.84 C4.2 arc-90 146.48,40.39 146.99,41.89 161.34,68.43 arc48 161.98,76.05 arc37 159.82,78.84 144.83,85.95 arc-25 139.12,90.4 arc-3 130.99,100.81 127.88,103.92 arc45 124.35,105.39 119.89,105.39
  Top 0.406: R5.1 109.02,107.42 arc-45 109.04,107.41 R5.1 | 119.89,105.39 114.2,105.39 arc-45 112.19,106.4 arc45 109.89,107.38 R5.1 | C16.2 60.16,107.65 arc-45 59.57,106.23 v59.49,106.15 arc45 59.32,106.12 59.25,106.19 | R6.1 60.66,103.64 arc-45 v61.01,104.5 | U7.2 arc-90 U7.2 63.43,98.53 | 63.43,98.53 v63.43,98.02 | v63.43,99.16 63.43,98.53 | v70.66,94.59 arc90 70.64,94.56 R2.1 70.64,90.88 arc-90 v67.74,87.99 77.84,87.99 arc-90 J4.5 | J5.5 45.77,72.37 arc-69 46.03,74.65 arc339 R21.2 | J4.5 arc-4 81.33,83.29 arc-31 R20.2 | v40.95,78.84 arc-58 40.31,84.3 | 40.31,84.3 arc-112 v45.26,85.32 | C12.2 98.06,30.8 arc90 102.67,35.41 102.67,35.75 arc-45 104.13,39.29 106.48,41.63 Q3.2 | U2.39_7 arc90 90.6,45.79 v90.6,53.7 90.6,51.12 arc-45 U2.15 | U11.1 75.45,69.35 arc90 76.38,68.43 82.73,68.43 arc90 84,69.7 | 84,69.7 84,74.65 arc45 84.01,74.65 C2.2 | R19.2 97.05,69.83 arc-45 J3.5 arc-70 97.84,66.78 arc-8 96.7,64.75 arc-72 C1.2 93.56,64.04 C18.2 arc-45 92.85,64.11 92.89,64.11 arc90 93.02,63.98 v93.91,63.98 | v87.68,53.7 arc-90 86.38,57.54 U10.1 arc45 86.56,61.19 v85.14,61.19 arc-90 84,62.33 84,69.7 | 86.13,22.73 arc-45 86.38,22.84 92.51,22.84 arc59 94.29,23.47 arc11 96.83,28.93 arc25 96.19,30.84 96.18,30.84 arc45 C12.2 | J4.5 82.05,85.91 arc-90 83.62,87.99 96.32,87.99 arc-90 100.26,84.05 100.26,82.27 arc-90 v99.75,81.76 | 40.31,84.3 42.53,86.52 arc-45 46.07,88.62 | 46.07,88.62 v64.7,87.99 | C20.- 20.76,89.45 arc45 24.29,88.62 46.07,88.62 | REG1.P$2 arc-45 102.19,107.42
  Top 0.61: Q2.4 117.06,87.19 arc90 v117.02,87.22 | v118.04,87.22 v119.05,87.22 | R11.2 112.52,85.52 arc-90 114.23,87.22 v117.02,87.22 | v117.02,87.22 117.02,85.19 | U8.2 97.62,81.53 arc45 98.48,81.89 C14.2 | C14.2 98.48,81.76 | C14.2 99.65,81.8 arc-45 v99.75,81.76 | C2.2 v82.99,74.65 arc-90 v82.98,74.65 C21.2 arc-45 C21.2 | C3.2 v40.95,78.84 | U12.1 v45.26,85.32 | 102.19,107.42 109.02,107.42 109.15,107.42
  Top 0.813: C15.2 70.25,95.58 arc45 v70.66,94.59 76.59,94.59 arc45 80.13,96.05 82.35,98.27 arc-44 91.87,102.08 96.32,102.08 arc90 100,105.77 arc-90 101.61,107.37 REG1.P$2 | v69.9,94.59 v69.14,94.59 | Q4.2 arc45 59.03,106.22 v58.6,106.66 | v59.49,106.15 arc-45 59.8,105.84 v60.5,105.51
  Bottom 0.406: v86.79,148.82 86.79,150.43 arc-90 LED6.3-GND | v17.45,40.23 LED4.3-GND | v75.87,13.95 75.87,14.71 arc-90 v77.78,16.99 86.03,16.99 | v86.03,16.36 86.03,16.99 | 86.03,16.99 v86.03,22.45 | v150.29,35.41 arc-5 151.94,34.52 LED2.3-GND | v61.01,104.5 arc9 61.9,103.73 61.95,103.69 | v90.6,53.7 v87.68,53.7 | v85.14,61.19 91.11,61.19 arc90 v93.91,63.98 | v85.4,13.06 85.4,14.83 arc-45 v86.03,16.36 | J1.GND 95.31,16.11 arc-90 94.03,14.83 93.11,14.83 arc-45 90.35,15.98 90.05,16.28 arc45 88.32,16.99 arc31 v86.03,16.36 | v64.7,87.99 v67.74,87.99 | 81.97,84.05 arc-45 82.05,84.16 J4.5 | 46.41,71.22 46.41,71.1 arc-45 46.41,71.11 J5.5
  Bottom 0.61: v118.04,87.22 v117.02,87.22 110.23,87.22 arc45 108.81,86.64 104.52,82.35 arc-45 103.11,81.76 v99.75,81.76 | v119.05,87.22 v120.07,87.22 | v82.98,74.65 82.98,78.01 arc45 82.4,79.43 82.05,79.78 arc-45 81.97,80.81 81.97,84.05 | v40.95,78.84 46.41,71.22
  Bottom 0.813: v70.66,94.59 v69.9,94.59 | v69.14,94.59 65.33,94.59 arc-100 63.43,96.5 v63.43,98.02 v63.43,99.16 63.43,100.75 arc45 61.95,103.69 58.47,106.78 arc28 53.52,108.56 52.06,108.56 arc-45 49.38,108.77 37.9,120.24 | v58.6,106.66 arc-45 59,106.39 v59.49,106.15 | v60.5,105.51 arc-45 60.47,105.3 v61.01,104.5
  Bottom 2.54: C20.- 28.47,89.52 arc45 32.01,90.98 40.57,99.54 arc45 41.96,102.92 41.96,116.82 arc68 39.3,120.75 39.37,120.68 arc45 39.8,120.5 39.79,120.51 arc45 C19.-
  other vias: 126.93,4.17 142.29,18.77 157.79,46.97 162.74,58.65 134.55,114.28 142.04,101.58 149.79,92.05 128.58,136.12 108,149.07 93.52,149.58 63.93,149.84 42.34,132.82 14.53,82.91 25.45,101.7 30.79,110.72 3.35,71.48 8.43,54.46 24.18,23.98 33.33,12.17 55.04,7.21 63.93,12.55 61.77,39.47 65.46,31.09 106.1,11.41 101.53,26.01 111.18,41.38 102.16,41 82.86,47.98 81.33,53.32 74.22,40.49 68.25,39.85 68.25,45.44 73.71,52.68 74.35,69.57 72.57,65.38 66.98,76.56 69.9,78.08 52.76,92.43 52.88,89.26 42.09,86.08 39.8,88.49 64.95,92.43 86.16,92.69 86.29,88.75 90.98,90.65 92.25,98.91 97.46,98.4 75.11,98.4 75.11,101.83 81.71,103.35 85.78,100.18 83.87,110.59 87.94,108.94 98.6,110.21 103.68,112.62 118.67,112.5 39.8,107.04 47.42,102.72 31.68,91.8 36.12,95.99 39.55,101.07 26.98,97.77 33.96,108.05 30.66,100.69 19.48,93.7 15.29,86.84 33.96,118.97 38.66,127.36 127.56,80.62 123.62,69.32 105.97,78.59 103.18,87.86 97.33,86.72 97.21,93.32 82.98,58.65 81.59,65.25 84.38,68.56 84.25,71.86 90.1,74.91 68.51,25.25 67.87,16.74 73.59,28.17 79.3,33.63 89.84,33.76 96.57,28.04 75.74,24.49 87.43,24.61 18.21,49.38 31.17,27.92 142.04,31.09 131.75,16.23 73.2,142.98 108.26,142.98 41.33,140.56 78.67,68.81 95.68,75.67 99.24,77.57 118.04,91.42 116.77,97.77 121.21,97.89 120.83,105.51 116.64,105.64 112.32,104.88 104.57,103.73 69.14,34.14
  pour Top: 43.99,155.68 arc-45 45.83,156.44 126.67,156.44 175.95,70.33 143.44,-4.22 37.01,-3.83 -5.79,58.01 -3.25,78.72 41.96,153.77
  pour Bottom: -8.08,73.51 42.09,154.53 76,157.96 130.1,153.9 176.2,72.24 163.63,31.47 133.66,-3.71 70.92,-3.71 38.66,-3.58 11.48,25.12 -7.06,58.14 -8.33,70.08
GND_RAW
  Top 0.61: 108.38,94.84 108.38,92.75 arc-45 107.8,91.34 107.41,90.95 arc45 106.82,89.53 R18.1 arc-45 106.73,88.23 106.73,84.51 arc90 Q7.4 | 108.38,94.84 108.38,94.97 | J2.3 arc-45 108.23,94.84 108.38,94.84 | 115.24,79.48 117.53,79.48 arc-90 118.04,78.97 118.04,78.42 | 118.04,78.42 arc-90 U3.6 | 118.04,78.42 arc90 118.12,78.33 120.58,78.33 120.58,78.21 120.59,78.21 arc90 C8.1 arc-90 120.72,78.33 121.46,78.33 arc90 122.61,79.48 122.61,84.43 arc90 121.76,85.28 Q1.4
  Top 0.64: Q7.4 108.5,79.18 C7.2 108.61,79.29 R10.2 111.2,79.48 115.24,79.48
IO0  (via drill 0.3 pad 0.81)
  Top 0.406: R15.1 83.07,7.19 Q6.3 v81.71,7.09 | U2.25 73.76,50.06 arc90 v73.71,50.01 | v69.39,32.74 arc30 v73.97,24.61
  Bottom 0.406: v81.71,7.09 81.71,7.98 arc90 78.92,10.77 77.27,10.77 arc-90 74.98,13.06 74.98,22.16 arc45 v73.97,24.61 | v73.71,50.01 arc-90 73.84,49.89 73.84,46.7 arc-45 72.95,44.55 arc45 72.57,43.63 72.57,40.62 arc20 73.2,37.06 arc-58 72.7,33.76 arc-45 70.24,32.74 v69.39,32.74
KICK  (via drill 0.3 pad 0.81)
  Top 0.406: 60.38,100.69 arc90 60.63,100.81 | 60.63,100.69 60.63,100.81 | R6.2 60.64,100.8 arc-90 60.63,100.81 | U2.9 91.7,43.71 arc-90 v91.62,43.79 | v82.86,54.33 arc-35 66.35,87.22 arc45 64.63,90.08 62.12,92.59 arc-45 60.66,96.13 R6.2 | Q4.1 arc45 57.59,100.81 60.76,100.81 arc-45 60.73,100.8 R6.2
  Bottom 0.406: v91.62,43.79 arc45 90.36,46.83 v82.86,54.33
KICKER  (1 unrouted)
  Top 2.54: J6.2 46.18,108.37 arc45 49.71,106.91 52.25,106.91 52.01,106.67 arc-45 51.36,106.4 51.52,106.56 arc-45 Q4.3
LEDS  (via drill 0.3 pad 0.81)
  Top 0.406: v150.93,33 LED1.4-DIN | U2.12 101.45,47.52 arc90 v101.53,47.47
  Bottom 0.406: v101.53,47.47 108.06,56.04 arc-45 114.77,58.78 117.53,59.03 arc41 122.86,62.71 136.45,86.72 arc-92 142.8,88.49 arc2 160.45,78.59 arc-83 162.99,72.37 arc-10 148.26,43.16 arc-1 145.72,38.2 arc70 146.36,35.54 arc-2 v150.93,33
M1A
  Top 0.406: U2.16 89.31,56.83 | 89.31,56.83 arc-45 89.59,57.51 arc45 89.84,58.12 89.84,60.82 arc45 U10.3 | 89.31,56.83 89.38,56.83 R22.1
M1B  (via drill 0.3 pad 0.81)
  Top 0.406: U10.2 arc-45 88.57,60.82 v88.57,58.78 87.67,57.88 R22.2 | U2.13 arc-45 93.55,48.87 v95.3,48.87
  Bottom 0.406: v88.57,58.78 90.79,57.19 arc-45 95.18,49.85 v95.3,48.87
M1C1  (via drill 0.3 pad 0.7)
  Top 0.406: U2.10 97.29,44.98 arc-90 v97.33,44.93
  Bottom 0.406: J3.4 98.99,70.11 98.99,66.65 97.33,65 v97.33,44.93
M1C2  (via drill 0.3 pad 0.7)
  Top 0.406: U2.11 98.65,46.25 arc90 v98.73,46.33
  Bottom 0.406: J3.3 99.81,71.87 99.81,66.2 98.35,64.75 v98.73,46.33
M1P1
  Top 0.406: U10.6 89.81,67 arc-90 90.98,68.17 96.34,68.17 arc90 J3.6
M1P2
  Top 0.406: U10.8 87.27,68.65 arc-90 90.98,72.24 93.87,72.24 arc45 97.4,73.7 97.46,73.76 arc-45 100.22,74.91 | 100.22,74.91 100.38,74.91 | 100.22,74.91 arc-45 100.24,74.91 J3.1
  Bottom 0.406: J3.1 arc-45 100.31,74.91 100.26,74.91
M2A  (via drill 0.3 pad 0.7)
  Top 0.406: U11.3 77.99,70.12 v78.03,70.21 | v77.9,46.2 77.43,46.2 U2.28
  Bottom 0.406: v78.03,70.21 78,70.18 arc45 77.01,67.79 77.01,49.12 arc34 v77.9,46.2
M2B  (via drill 0.3 pad 0.7)
  Top 0.406: U11.2 76.72,70.17 v76.63,70.21 | v74.6,43.66 76.38,43.66 U2.30
  Bottom 0.406: v76.63,70.21 arc45 75.49,67.78 75.49,45.51 arc-45 v74.6,43.66
M2C1  (via drill 0.3 pad 0.81)
  Top 0.406: v80.57,42.52 arc-45 80.38,42.44 U2.31
  Bottom 0.406: J4.4 arc-45 80.32,84.22 arc45 80.19,83.92 79.81,79.35 arc51 80.95,76.94 arc-45 81.84,74.79 81.84,69.28 arc-45 80.7,66.52 arc45 79.81,64.63 79.81,50.22 arc45 80.19,49 arc-45 80.57,48.08 v80.57,42.52
M2C2  (via drill 0.3 pad 0.7)
  Top 0.406: U2.33 v78.28,39.98
  Bottom 0.406: v78.28,39.98 78.28,43.07 arc-45 78.79,44.3 79.07,44.57 arc45 79.43,45.44 79.43,46.83 arc45 78.79,48.36 arc-45 78.54,48.98 78.54,65.57 arc-45 79.3,67.41 80.07,68.31 arc45 80.7,69.83 80.7,73.21 arc45 79.68,75.67 79.44,75.91 arc-45 78.54,78.08 78.92,83.98 arc45 J4.3
M2P1
  Top 0.406: U11.6 78.03,78.21 arc-97 78.79,78.84 arc22 82.09,78.84 arc55 83.36,79.73 arc25 83.49,80.49 arc-4 J4.6
M2P2
  Top 0.406: U11.8 75.49,77.83 arc13 75.36,79.86 arc-20 75.49,83.92 75.62,84.05 arc-45 J4.1
M3A  (via drill 0.3 pad 0.7)
  Top 0.406: U12.3 v42.98,84.18 | U2.36 72.19,36.04 arc54 v70.28,35.03
  Bottom 0.406: v42.98,84.18 arc105 47.68,81 arc-65 55.68,76.94 69.01,52.93 arc-45 71.17,46.98 71.17,46.84 71.17,46.71 71.17,46.11 arc-45 70.79,45.19 arc45 70.28,43.96 v70.28,35.03
M3B  (via drill 0.3 pad 0.7, 0.3 pad 0.81)
  Top 0.406: U12.2 v44.12,84.81 | U2.37 v71.88,34.82 arc45 72.19,34.77
  Bottom 0.406: 44.48,84.04 44.12,84.94 v44.12,84.81 arc90 47.42,82.27 50.69,82.02 arc-45 55.62,78.9 55.68,78.84 69.52,55.35 arc-44 72.44,46.46 72.44,46.52 | v71.88,34.82 arc-45 71.3,36.84 71.3,43.76 arc-45 71.68,44.68 arc45 72.44,46.52 | 72.44,46.52 72.44,47.98
M3C1  (via drill 0.3 pad 0.7)
  Top 0.406: U2.26 71.13,48.79 arc45 v68.25,47.6
  Bottom 0.406: J5.4 48.19,70.97 arc78 51.23,70.59 arc-77 55.42,69.19 v68.25,47.6
M3C2  (via drill 0.3 pad 0.7)
  Top 0.406: v70.03,47.47 76.25,47.47 arc45 U2.27
  Bottom 0.406: J5.3 49.2,72.11 arc79 50.98,71.73 arc-87 56.06,70.21 v70.03,47.47
M3P1
  Top 0.406: U12.6 46.79,77.57 arc-100 46.53,76.81 arc18 43.74,75.16 arc73 43.36,73.64 arc13 J5.6
M3P2
  Top 0.406: U12.8 51.64,74.18 J5.1
N$1
  Top 0.406: L1.1 arc45 64.8,105.51 64.82,105.51
  Top 0.61: U7.1 64.97,99.74 arc45 64.95,99.8
  Top 0.813: 64.95,99.8 arc-90 64.82,99.92 64.82,105.51 64.82,105.64 | L1.1 64.76,108.36 arc-45 65.35,109.78 D1.2
N$2
  Top 0.406: D1.1 62.95,110.5 arc-90 62.54,110.08 arc90 61.86,109.41 C16.1 61.86,106.86 arc45 62.03,106.4 arc-45 62.28,105.74 62.28,97.13 arc90 64.31,95.1 arc90 R4.2
  Top 0.813: D1.1 60.23,111.78 arc45 R14.2
N$3
  Top 0.406: R8.1 105.36,44.27 arc-45 Q3.1
N$4
  Top 0.406: U7.3 64.97,96.98 arc90 65.46,96.5 65.58,96.5 arc-90 66.09,95.99 R4.1 | R2.2 68.09,92.98 arc-90 66.09,94.98 R4.1 | R4.1 arc90 R4.1
N$5  (1 unrouted)
  Top 0.406: Q3.3 108.93,41.36 arc-45 107.47,37.82 B1.P$1
N$6
  Top 0.406: U1.1 71.75,15.37 arc45 70.92,17.37 arc-45 70.66,18.45 70.72,19.66 arc33 68.12,29.19 arc-116 70.54,38.33 arc-16 73.08,38.58 U2.34
N$7
  Bottom 1.016: J2.2 104.62,90.22 arc45 106.04,89.64 120.26,89.64 arc-45 121.67,89.05 122.35,88.37 arc90 126.54,88.37 SW1.P$2
N$8
  Top 0.406: U3.5 arc90 117.02,78.35 117.02,76.73 arc45 R7.1 120.36,76.36 arc45 C8.2
N$9
  Top 0.406: U3.4 arc-90 115.92,78.21 113.97,78.21 R9.2 | 111.12,77.45 arc-90 R10.1
  Top 0.64: 111.12,77.45 114.02,77.45 R9.2
  Top 0.75: R10.1 108.61,77.49 C7.1
N$10
  Top 0.406: Q2.5 Q2.6 | Q1.5 Q1.6 | Q1.2 Q1.1
  Top 0.61: Q1.5 119.52,85.28 arc90 119.43,85.19 119.43,83.06 arc-90 Q1.1 119.35,84.14 arc90 119.31,84.18 116.13,84.18 | 116.13,84.18 116.13,85.25 arc90 Q2.5 | Q2.1 Q2.2 116.11,84.15 arc-90 116.13,84.18
N$11
  Top 0.406: U3.2 117.04,82.46 Q2.3
N$12
  Top 0.61: U3.1 120,80.68 arc90 121.26,81.89 121.26,82.91 arc-90 121.25,82.92 Q1.3
N$13
  Top 0.61: U3.3 114.89,80.68 arc-90 R11.1 arc-90 112.35,82.87
  Top 0.64: D2.2 112.52,81.26 R11.1
N$14  (via drill 0.3 pad 0.81)
  Top 0.406: U1.5 74.35,10.82 arc-45 v74.22,10.52 | U2.35 71.4,37.38 arc81 67.74,33.38 arc45 68.46,30.51 69.01,29.69 arc-10 v72.95,22.71
  Bottom 0.406: v74.22,10.52 arc-90 72.95,11.79 v72.95,22.71
N$15
  Top 0.406: U1.4 73.7,13.68 arc-90 75.11,15.09 78.3,15.09 arc-45 80.82,13.56 arc45 81.74,13.18 82.35,13.18 82.35,13.12 arc90 C9.1 arc13 82.35,14.83 arc83 80.19,16.74 arc-90 78.9,18.03 U1.17
N$16
  Top 0.406: R16.2 71.83,5.97 Q5.1
N$17
  Top 0.406: R17.2 77.96,8.21 Q6.1
N$18
  Top 0.406: U10.7 88.54,66.12 arc-45 90,69.65 R19.1
N$19
  Top 0.406: C17.2 R18.2 arc90 108.5,88.32 Q7.3
N$20
  Top 0.406: U11.7 76.76,78.08 arc-26 R20.1
N$21
  Top 0.406: U12.7 48.19,77.57 arc-39 R21.1
N$22  (2 unrouted)
  Top 0.64: Q7.6 Q7.5 109.45,82.53 109.91,82.53 109.91,81.26 D2.1
N$27  (via drill 0.3 pad 0.81)
  Top 0.406: v150.29,38.2 arc6 LED1.2-DOUT
  Bottom 0.406: LED2.4-DIN v150.29,38.2
N$28  (via drill 0.3 pad 0.81)
  Top 0.406: LED3.4-DIN arc90 14.53,37.96 14.53,37.95 arc33 15.17,35.79 arc50 v23.17,30.71
  Bottom 0.406: v23.17,30.71 arc-40 28.25,28.04 arc-6 44.88,7.09 arc52 51.49,4.17 arc-10 60.5,3.53 arc30 68,3.79 arc-17 69.39,3.91 arc-3 104.32,3.79 arc-15 105.59,3.4 arc13 108.13,3.02 arc7 115.88,2.64 118.12,2.64 arc45 121.91,3.98 146.21,28.65 arc-45 148.9,30.33 arc50 152.2,31.47 arc74 153.85,35.28 arc-72 154.36,38.71 arc45 LED2.2-DOUT
N$30  (via drill 0.3 pad 0.7)
  Top 0.406: v84.38,150.47 LED5.4-DIN
  Bottom 0.406: v84.38,150.47 arc90 82.09,152.76 79.55,152.76 arc65 72.19,148.06 arc-64 63.17,142.22 47.21,142.22 arc45 43.67,140.75 42.72,139.8 25.96,108.05 arc-9 23.8,104.62 arc4 7.8,78.33 arc63 7.67,70.97 arc-19 13.26,55.22 arc-21 13.39,46.33 arc42 15.55,35.79 arc100 18.59,35.41 LED4.2-DOUT
N$32  (via drill 0.3 pad 0.7)
  Top 0.406: LED5.2-DOUT v84.38,147.17
  Bottom 0.406: v84.38,147.17 LED6.4-DIN
N$39  (via drill 0.3 pad 0.7)
  Top 0.406: LED3.2-DOUT v20.25,38.96
  Bottom 0.406: v20.25,38.96 LED4.4-DIN
N$59  (via drill 0.3 pad 0.7)
  Top 0.406: R12.1 arc90 85.1,20.68 v86.92,20.68
  Bottom 0.406: v86.92,20.68 87.94,20.68 arc-45 88.8,20.32 89.71,19.66 arc45 91.5,19.1 J1.D-
N$60  (via drill 0.3 pad 0.7)
  Top 0.406: R13.1 arc90 85.18,18.52 v86.92,18.52 86.16,18.52
  Bottom 0.406: v86.92,18.52 87.94,18.52 arc-49 89.46,18.01 89.57,17.9 arc45 J1.D+
RTS
  Top 0.406: U1.3 73.08,10.39 | 73.97,8.1 arc289 R17.1 73.96,8.22 arc-90 73.97,8.23 | Q5.2 arc-90 71.98,8.1 73.97,8.1 | 73.97,8.1 73.97,8.23 | 73.97,8.23 73.97,9.12 arc90 73.46,9.63 arc-90 73.08,10.01 73.08,10.39 | 73.08,10.52 73.08,10.39
USBDM
  Top 0.406: U1.16 79.55,20.54 arc-90 80.32,21.57 80.7,21.57 arc-90 81.21,21.06 arc90 81.59,20.68 83.24,20.68 83.24,20.71 arc-90 R12.2 arc90 83.33,20.8 C10.2
USBDP
  Top 0.406: U1.15 arc-90 80.23,19.53 81.33,19.53 arc-90 81.84,19.15 arc90 82.22,18.64 83.36,18.64 | 83.36,18.64 C11.2 | 83.36,18.64 arc-90 R13.2 | 83.36,16.36 C11.2 | C11.2 arc90 C11.2
VCC  (via drill 0.3 pad 0.81, 0.6)  (2 unrouted)
  Top 0.406: C6.1 79.94,144.76 79.98,146.78 v79.99,147.18 80.06,150.47 LED5.1-VDD | v120.32,107.8 v116.64,107.8 | LED3.1-VDD arc90 19.63,34.14 19.74,34.14 arc53 v22.53,35.03 | v22.53,35.03 arc74 23.17,39.09 | 23.17,39.09 arc304 23.17,38.96 arc56 23.17,39.09 | C5.1 23.17,39.09 | v22.53,35.03 43.18,9.34 arc39 52.12,4.29 arc11 63.68,3.28 arc22 68.25,3.66 arc-29 69.39,3.79 100.52,3.91 arc45 102.03,4.67 102.35,4.99 arc45 103.81,8.52 v103.81,14.45 arc-31 107.62,13.31 arc4 118.54,6.96 arc73 125.66,7.72 146.61,29.06 arc-45 149.37,30.2 149.02,30.2 arc90 154.74,36.68 154.87,38.22 arc90 LED1.1-VDD arc8 v152.96,39.6 152.96,40.36 arc90 151.18,42.39 150.93,42.39 arc45 149.22,41.58 C4.1 | 98.6,79.22 arc45 98.3,79.35 95.43,79.35 arc-45 94.35,76.75 v93.27,75.67 | v98.99,26.39 arc90 98.94,26.35 D3.1 | 101.78,104.62 101.92,104.77 arc-45 REG1.P$3
  Top 0.61: U8.1 98.6,79.22 arc90 101.78,82.4 101.78,85.25 arc45 101.19,86.67 100.08,87.78 arc-45 99.49,89.2 99.49,98.53 arc-45 100.57,101.13 100.64,101.19 arc45 101.78,103.95 101.78,104.62 | 101.93,104.69 REG1.P$3
  Bottom 0.406: LED6.1-VDD v79.99,147.18 79.99,146.23 arc90 81.46,144.76 109.11,144.76 arc-45 112.64,143.29 112.96,142.98 arc45 115.71,142.09 121.59,142.09 arc-90 125.91,137.52 125.91,114.4 arc-90 v120.32,107.8 | LED4.1-VDD 21.39,36.93 v22.53,35.03 | v116.64,107.8 111.26,107.8 arc45 109.02,106.91 107.69,105.83 arc-45 104.53,104.75 102.03,104.75 | LED2.1-VDD v152.96,39.6 | v93.27,75.67 93.27,71.13 arc45 94.73,67.6 95.43,66.9 arc-45 95.81,65.98 95.81,51.54 arc33 96.19,50.27 arc-42 96.45,49.12 arc18 96.57,40.49 arc70 97.84,39.22 arc-39 100.76,37.57 arc-51 101.78,33.88 arc-20 v98.99,26.39 98.99,20.33 arc45 99.81,18.58 103.18,15.97 arc-45 v103.81,14.45
  Bottom 0.61: 102.03,104.75 arc-45 102.06,104.81 REG1.P$3
VIN  (via drill 0.3 pad 0.81)  (2 unrouted)
  Top 0.406: U7.5 U7.4 arc90 67.39,97.51 70.28,97.51 | R7.2 116.97,74.49 115.55,74.49 arc-90 R9.1 | 42.83,77.83 C3.1 | 117.59,74.52 122.26,74.52 arc90 124.39,76.65 124.39,84.94 arc30 123.62,87.22 arc-35 123.12,89 123.12,91.49 arc-90 SW1.P$1 arc90 124.01,92.69 115.11,92.69 arc90 112.23,89.8 C17.1 | 70.28,97.51 70.41,97.51 arc90 70.28,97.64 | C15.1 70.25,97.54 arc90 70.28,97.51 | 79.3,77.06 arc-26 U11.5 | C18.1 arc-45 92.8,65.89 92.76,65.89
  Top 0.61: 117.53,74.52 117.59,74.52 arc-90 R7.2 | R3.2 104.08,111.09 arc45 102.67,110.5 REG1.P$1 | 79.43,76.94 arc90 79.3,77.06 | C21.1 arc-90 81.65,76.43 81.59,76.43 | C2.1 arc-90 84.2,76.5 v86.65,76.5 | U12.5 arc45 U12.5 44.25,77.19 arc-120 42.85,77.83 arc-97 42.83,77.83 | C22.1 C3.1 v39.93,76.18 | U10.5 92.56,66.09 arc-90 92.76,65.89 v93.91,65.89 arc90 93.91,65.88 C1.1
  Top 0.813: C21.1 arc90 81.69,76.43 | v86.65,76.5 arc-90 86.58,76.43 81.59,76.43 81.46,76.43 arc90 80.95,76.94 79.43,76.94
  Top 1.016: L1.2 69.88,100.59 arc90 v70.28,100.18 arc90 70.25,100.15 C15.1
  Bottom 0.406: 102.5,110.34 REG1.P$1 102.03,109.96 arc-45 102.03,109.96 | 102.16,109.83 102.03,109.96 | 102.03,109.96 arc-45 102.12,110.17 102.41,110.47
  Bottom 0.61: 40.64,86.67 40.69,86.72 | 88.7,91.73 arc-90 88,91.03 47.08,91.03 arc45 43.55,89.57 40.69,86.72 | v93.91,65.89 89.97,65.89 arc-90 86.54,68.94 86.54,76.48 arc90 v86.65,76.5 | v39.93,76.18 38.79,78.46 arc-66 39.04,84.68 arc-8 40.69,86.72
  Bottom 0.813: v86.65,76.5 86.7,76.5 arc90 88.7,78.5 88.7,91.73 arc-45 89.28,93.02 96.57,100.05 99.54,103.02 arc45 100.13,104.44 100.13,108.18 | 90.7,112.24 91.87,112.24 | 100.13,108.18 100.13,108.24 | 102.03,109.96 101.91,109.96 arc90 100.13,108.18
  Bottom 1.016: SW1.P$1 123.9,92.53 arc-90 118.54,97.89 118.54,108.22 arc45 118.04,109.45 arc45 116.92,109.91 REG1.P$1 | v70.28,100.18 79.81,100.18 arc90 85.14,105.51 85.14,107.54 arc-90 89.84,112.24 91.87,112.24 99.75,112.24 arc-90 102.16,109.83
VOLTAGE  (via drill 0.3 pad 0.81)
  Top 0.406: R5.2 R3.1 111.85,109.29 arc-90 v114.73,106.4 | v103.3,84.56 v103.3,78.72 | U2.6 arc-90 93.4,39.87 93.4,39.85 93.52,39.85 arc-90 93.65,39.98 arc37 v98.6,41.63
  Bottom 0.406: v114.73,106.4 114.73,104.72 arc-90 112.73,102.72 104.19,102.72 arc58 99.62,100.18 arc30 99.11,98.53 99.11,89.07 arc45 99.7,87.65 v103.3,84.56 | v103.3,78.72 103.68,78.33 arc-42 104.83,75.79 arc-27 101.65,54.46 arc27 100.13,45.7 arc-53 v98.6,41.63
VSTORE  (2 unrouted)
  Top 0.813: R14.1 54.06,111.76 arc-45 52.38,111.99 52.33,112.04 arc45 50.02,112.75 45.71,112.75 arc45 44.68,112.55 44.38,112.24 arc-45 44.11,111.59 43.49,110.97 43.23,110.66 arc-90 J6.1
  Top 2.54: J6.1 40.53,111.94 37.26,114.7 arc-45 36.76,115.93 arc-45 36.73,115.98 C19.+
  Bottom 2.54: C20.+ 26.01,93.92 arc45 29.55,95.38 35.36,101.19 arc45 36.76,104.57 36.76,116.27 arc45 C19.+
VUSB  (via drill 0.3 pad 0.81)
  Top 0.406: U1.20 76.95,22.82 arc-45 v77.27,23.34 | D3.2 arc45 96.65,23.77 96.7,23.85 95.86,23.85 arc45 v95.56,23.72
  Bottom 0.406: v77.27,23.34 arc-45 78.19,23.72 v95.56,23.72 95.56,19.73 arc-45 95.3,19.11 arc45 J1.VBUS

### Text on the board
tPlace: GND
tNames: Robot Soccer Kit rev2